# Altium project PAY_IF.PrjPcb (part 2 of 3)

## Sheet SAMA7D65_PIO.SchDoc
size 420 x 297 mm; SheetNumber: 8; SheetTotal: 23
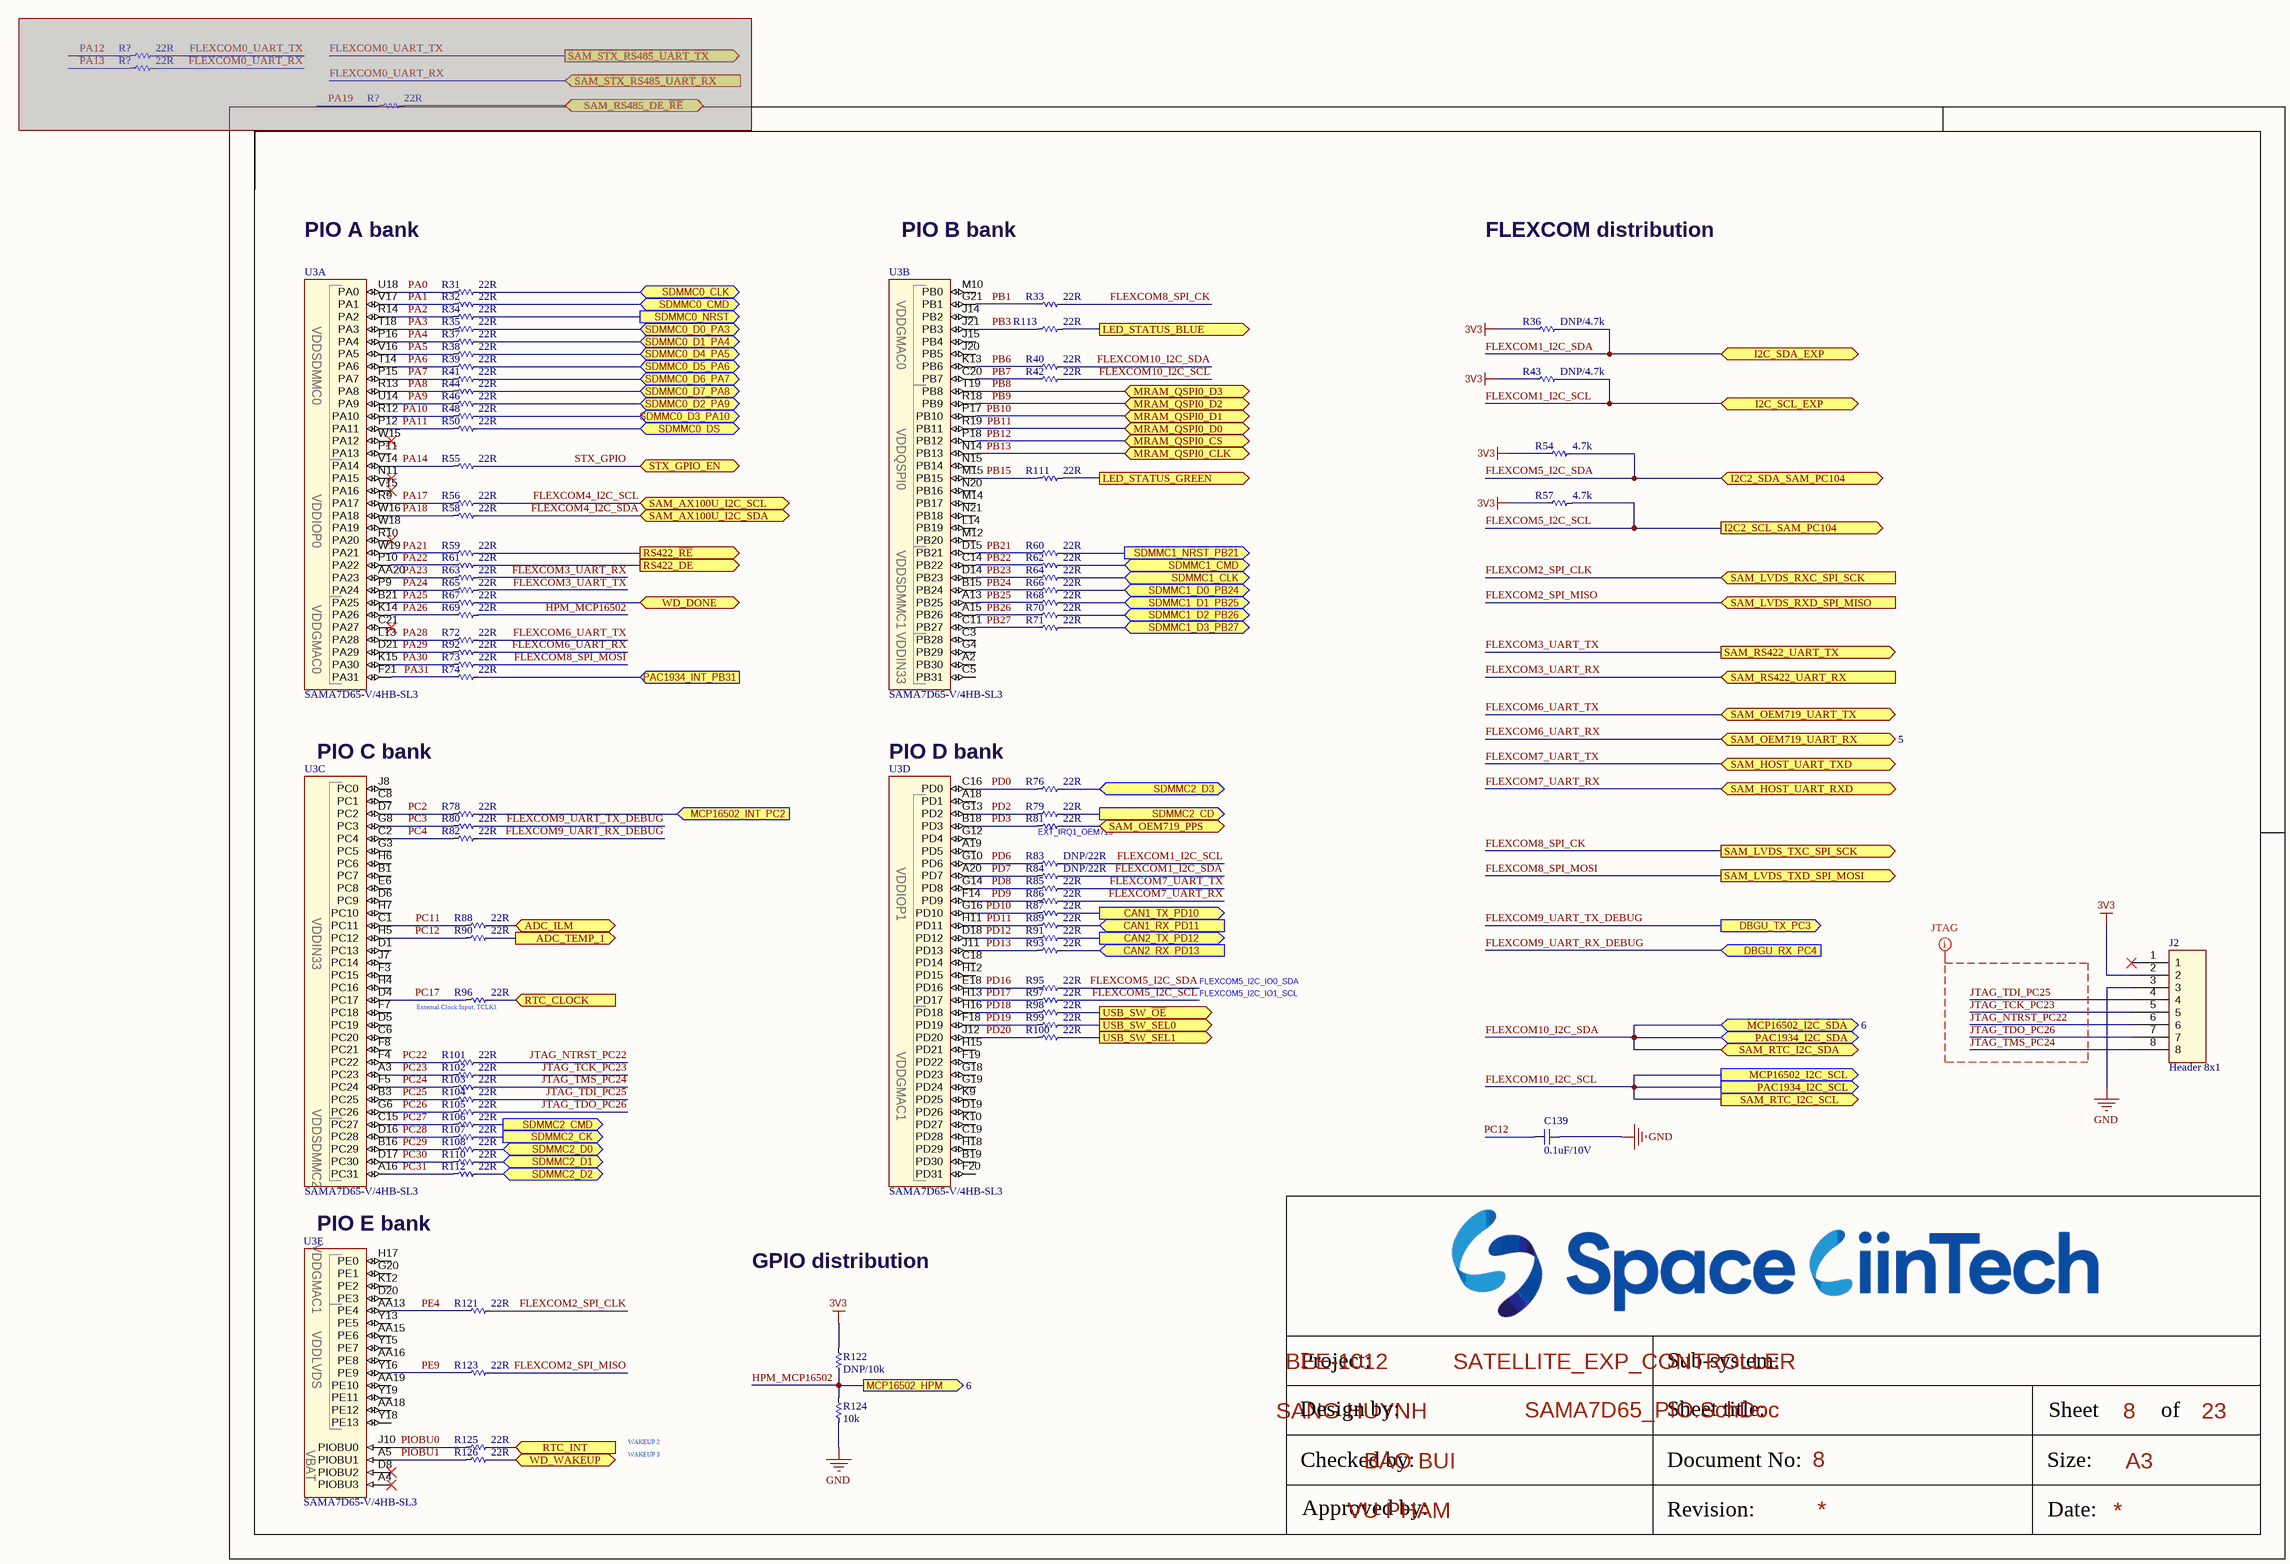
[diagram p8: SAMA7D65_PIO.SchDoc]

### Parts
(Parts that share a designator on the sheet are numbered #1, #2 ... from top to bottom, then left to right.)
C139  0.1uF/10V  [CAP_C_0603x30]
J2  Header 8x1  [Header_254P_8x1]
R31  22R  [RES_C_0603X30]
R32  22R  [RES_C_0603X30]
R33  22R  [RES_C_0603X30]
R34  22R  [RES_C_0603X30]
R35  22R  [RES_C_0603X30]
R36  DNP/4.7k  [RES_C_0603X30]
R37  22R  [RES_C_0603X30]
R38  22R  [RES_C_0603X30]
R39  22R  [RES_C_0603X30]
R40  22R  [RES_C_0603X30]
R41  22R  [RES_C_0603X30]
R42  22R  [RES_C_0603X30]
R43  DNP/4.7k  [RES_C_0603X30]
R44  22R  [RES_C_0603X30]
R46  22R  [RES_C_0603X30]
R48  22R  [RES_C_0603X30]
R50  22R  [RES_C_0603X30]
R54  4.7k  [RES_C_0603X30]
R55  22R  [RES_C_0603X30]
R56  22R  [RES_C_0603X30]
R57  4.7k  [RES_C_0603X30]
R58  22R  [RES_C_0603X30]
R59  22R  [RES_C_0603X30]
R60  22R  [RES_C_0603X30]
R61  22R  [RES_C_0603X30]
R62  22R  [RES_C_0603X30]
R63  22R  [RES_C_0603X30]
R64  22R  [RES_C_0603X30]
R65  22R  [RES_C_0603X30]
R66  22R  [RES_C_0603X30]
R67  22R  [RES_C_0603X30]
R68  22R  [RES_C_0603X30]
R69  22R  [RES_C_0603X30]
R70  22R  [RES_C_0603X30]
R71  22R  [RES_C_0603X30]
R72  22R  [RES_C_0603X30]
R73  22R  [RES_C_0603X30]
R74  22R  [RES_C_0603X30]
R76  22R  [RES_C_0603X30]
R78  22R  [RES_C_0603X30]
R79  22R  [RES_C_0603X30]
R80  22R  [RES_C_0603X30]
R81  22R  [RES_C_0603X30]
R82  22R  [RES_C_0603X30]
R83  DNP/22R  [RES_C_0603X30]
R84  DNP/22R  [RES_C_0603X30]
R85  22R  [RES_C_0603X30]
R86  22R  [RES_C_0603X30]
R87  22R  [RES_C_0603X30]
R88  22R  [RES_C_0603X30]
R89  22R  [RES_C_0603X30]
R90  22R  [RES_C_0603X30]
R91  22R  [RES_C_0603X30]
R92  22R  [RES_C_0603X30]
R93  22R  [RES_C_0603X30]
R95  22R  [RES_C_0603X30]
R96  22R  [RES_C_0603X30]
R97  22R  [RES_C_0603X30]
R98  22R  [RES_C_0603X30]
R99  22R  [RES_C_0603X30]
R100  22R  [RES_C_0603X30]
R101  22R  [RES_C_0603X30]
R102  22R  [RES_C_0603X30]
R103  22R  [RES_C_0603X30]
R104  22R  [RES_C_0603X30]
R105  22R  [RES_C_0603X30]
R106  22R  [RES_C_0603X30]
R107  22R  [RES_C_0603X30]
R108  22R  [RES_C_0603X30]
R110  22R  [RES_C_0603X30]
R111  22R  [RES_C_0603X30]
R112  22R  [RES_C_0603X30]
R113  22R  [RES_C_0603X30]
R121  22R  [RES_C_0603X30]
R122  DNP/10k  [RES_C_1005x30_L]
R123  22R  [RES_C_0603X30]
R124  10k  [RES_C_1005x30_L]
R125  22R  [RES_C_0603X30]
R126  22R  [RES_C_0603X30]
R?#1  22R  [RES_C_0603X30]  (masked out: inside a compile mask, not in the netlist)
R?#2  22R  [RES_C_0603X30]  (masked out: inside a compile mask, not in the netlist)
R?#3  22R  [RES_C_0603X30]  (masked out: inside a compile mask, not in the netlist)
U3#2  value SAMA7D65-V/4HB-SL3  [TFBGA-343_14x14]  (hidden comment: SAMA7D65)  (parts A,B,C,D,E of 8)

### Ports
ADC_ILM (bidir, see 3), ADC_TEMP_1 (out, see 15), CAN1_RX_PD11 (in, see 19), CAN1_TX_PD10 (out, see 19), CAN2_RX_PD13 (in, see 19), CAN2_TX_PD12 (out, see 19), DBGU_RX_PC4 (in, see 14), DBGU_TX_PC3 (out, see 14), I2C2_SCL_SAM_PC104 (out, see 5), I2C2_SDA_SAM_PC104 (bidir, see 5), I2C_SCL_EXP (bidir, see 4, 5), I2C_SDA_EXP (bidir, see 4, 5), LED_STATUS_BLUE (out, see 22), LED_STATUS_GREEN (out, see 22), MCP16502_HPM (out, see 6), MCP16502_I2C_SCL (out, see 6), MCP16502_I2C_SDA (bidir, see 6), MCP16502_INT_PC2 (in, see 6), MRAM_QSPI0_CLK (bidir, see 12), MRAM_QSPI0_CS (bidir, see 12), MRAM_QSPI0_D0 (bidir, see 12), MRAM_QSPI0_D1 (bidir, see 12), MRAM_QSPI0_D2 (bidir, see 12), MRAM_QSPI0_D3 (bidir, see 12), PAC1934_I2C_SCL (out, see 6), PAC1934_I2C_SDA (bidir, see 6), PAC1934_INT_PB31 (in, see 6), RS422_DE (out, see 21), RS422_~{RE} (out, see 21), RTC_CLOCK (in, see 16), RTC_INT (in, see 16), SAM_AX100U_I2C_SCL (bidir, see 5), SAM_AX100U_I2C_SDA (bidir, see 5), SAM_HOST_UART_RXD (bidir, see 5), SAM_HOST_UART_TXD (bidir, see 5), SAM_LVDS_RXC_SPI_SCK (in, see 18), SAM_LVDS_RXD_SPI_MISO (in, see 18), SAM_LVDS_TXC_SPI_SCK (out, see 18), SAM_LVDS_TXD_SPI_MOSI (out, see 18), SAM_OEM719_PPS (bidir, see 5), SAM_OEM719_UART_RX (bidir, see 5), SAM_OEM719_UART_TX (bidir, see 5), SAM_RS422_UART_RX (in, see 21), SAM_RS422_UART_TX (out, see 21), SAM_RS485_DE_~{RE} (bidir), SAM_RTC_I2C_SCL (out, see 16), SAM_RTC_I2C_SDA (bidir, see 16), SAM_STX_RS485_UART_RX (in), SAM_STX_RS485_UART_TX (out), SDMMC0_CLK (bidir, see 11), SDMMC0_CMD (bidir, see 11), SDMMC0_D0_PA3 (bidir, see 11), SDMMC0_D1_PA4 (bidir, see 11), SDMMC0_D2_PA9 (bidir, see 11), SDMMC0_D3_PA10 (bidir, see 11), SDMMC0_D4_PA5 (bidir, see 11), SDMMC0_D5_PA6 (bidir, see 11), SDMMC0_D6_PA7 (bidir, see 11), SDMMC0_D7_PA8 (bidir, see 11), SDMMC0_DS (bidir, see 11), SDMMC0_NRST (out, see 11), SDMMC1_CLK (bidir, see 11), SDMMC1_CMD (bidir, see 11), SDMMC1_D0_PB24 (bidir, see 11), SDMMC1_D1_PB25 (bidir, see 11), SDMMC1_D2_PB26 (bidir, see 11), SDMMC1_D3_PB27 (bidir, see 11), SDMMC1_NRST_PB21 (out, see 11), SDMMC2_CD (out, see 10), SDMMC2_CK (out, see 10), SDMMC2_CMD (out, see 10), SDMMC2_D0 (bidir, see 10), SDMMC2_D1 (bidir, see 10), SDMMC2_D2 (bidir, see 10), SDMMC2_D3 (bidir, see 10), STX_GPIO_EN (bidir, see 5), USB_SW_SEL0 (out, see 13), USB_SW_SEL1 (out, see 13), USB_SW_~{OE} (out, see 13), WD_DONE (bidir, see 17), WD_WAKEUP (bidir, see 17)

### Nets
3V3: J2.2 R36.1 R43.1 R54.1 R57.1 R122.1
GND: C139.1 J2.3 R124.2
ADC_TEMP_1: R90.2 ; port ADC_TEMP_1
FLEXCOM1_I2C_SCL: R43.2 R83.2 ; port I2C_SCL_EXP
FLEXCOM1_I2C_SDA: R36.2 R84.2 ; port I2C_SDA_EXP
FLEXCOM2_SPI_CLK: R121.2 ; port SAM_LVDS_RXC_SPI_SCK
FLEXCOM2_SPI_MISO: R123.2 ; port SAM_LVDS_RXD_SPI_MISO
FLEXCOM3_UART_RX: R63.2 ; port SAM_RS422_UART_RX
FLEXCOM3_UART_TX: R65.2 ; port SAM_RS422_UART_TX
FLEXCOM4_I2C_SCL: R56.2 ; port SAM_AX100U_I2C_SCL
FLEXCOM4_I2C_SDA: R58.2 ; port SAM_AX100U_I2C_SDA
FLEXCOM5_I2C_SCL: R57.2 R97.2 ; port I2C2_SCL_SAM_PC104
FLEXCOM5_I2C_SDA: R54.2 R95.2 ; port I2C2_SDA_SAM_PC104
FLEXCOM6_UART_RX: R92.2 ; port SAM_OEM719_UART_RX
FLEXCOM6_UART_TX: R72.2 ; port SAM_OEM719_UART_TX
FLEXCOM7_UART_RX: R86.2 ; port SAM_HOST_UART_RXD
FLEXCOM7_UART_TX: R85.2 ; port SAM_HOST_UART_TXD
FLEXCOM8_SPI_CK: R33.2 ; port SAM_LVDS_TXC_SPI_SCK
FLEXCOM8_SPI_MOSI: R73.2 ; port SAM_LVDS_TXD_SPI_MOSI
FLEXCOM9_UART_RX_DEBUG: R82.2 ; port DBGU_RX_PC4
FLEXCOM9_UART_TX_DEBUG: R80.2 ; port DBGU_TX_PC3
FLEXCOM10_I2C_SCL: R42.2 ; port MCP16502_I2C_SCL, port PAC1934_I2C_SCL, port SAM_RTC_I2C_SCL
FLEXCOM10_I2C_SDA: R40.2 ; port MCP16502_I2C_SDA, port PAC1934_I2C_SDA, port SAM_RTC_I2C_SDA
HPM_MCP16502: R69.2 R122.2 R124.1 ; port MCP16502_HPM
JTAG_NTRST_PC22: J2.6 R101.2
JTAG_TCK_PC23: J2.5 R102.2
JTAG_TDI_PC25: J2.4 R104.2
JTAG_TDO_PC26: J2.7 R105.2
JTAG_TMS_PC24: J2.8 R103.2
PA0: R31.1 U3#2.U18(PA0)
PA1: R32.1 U3#2.V17(PA1)
PA2: R34.1 U3#2.R14(PA2)
PA3: R35.1 U3#2.T18(PA3)
PA4: R37.1 U3#2.P16(PA4)
PA5: R38.1 U3#2.V16(PA5)
PA6: R39.1 U3#2.T14(PA6)
PA7: R41.1 U3#2.P15(PA7)
PA8: R44.1 U3#2.R13(PA8)
PA9: R46.1 U3#2.U14(PA9)
PA10: R48.1 U3#2.R12(PA10)
PA11: R50.1 U3#2.P12(PA11)
PA14: R55.1 U3#2.V14(PA14)
PA17: R56.1 U3#2.R9(PA17)
PA18: R58.1 U3#2.W16(PA18)
PA21: R59.1 U3#2.W19(PA21)
PA22: R61.1 U3#2.P10(PA22)
PA23: R63.1 U3#2.AA20(PA23)
PA24: R65.1 U3#2.P9(PA24)
PA25: R67.1 U3#2.B21(PA25)
PA26: R69.1 U3#2.K14(PA26)
PA28: R72.1 U3#2.L13(PA28)
PA29: R92.1 U3#2.D21(PA29)
PA30: R73.1 U3#2.K15(PA30)
PA31: R74.1 U3#2.F21(PA31)
PB1: R33.1 U3#2.G21(PB1)
PB3: R113.1 U3#2.J21(PB3)
PB6: R40.1 U3#2.K13(PB6)
PB7: R42.1 U3#2.C20(PB7)
PB8: U3#2.T19(PB8) ; port MRAM_QSPI0_D3  [project net MRAM_QSPI_D3]
PB9: U3#2.R18(PB9) ; port MRAM_QSPI0_D2  [project net MRAM_QSPI_D2]
PB10: U3#2.P17(PB10) ; port MRAM_QSPI0_D1  [project net MRAM_QSPI_D1]
PB11: U3#2.R19(PB11) ; port MRAM_QSPI0_D0  [project net MRAM_QSPI_D0]
PB12: U3#2.P18(PB12) ; port MRAM_QSPI0_CS  [project net MRAM_QSPI_CS]
PB13: U3#2.N14(PB13) ; port MRAM_QSPI0_CLK  [project net MRAM_QSPI_CLK]
PB15: R111.1 U3#2.M15(PB15)
PB21: R60.1 U3#2.D15(PB21)
PB22: R62.1 U3#2.C14(PB22)
PB23: R64.1 U3#2.D14(PB23)
PB24: R66.1 U3#2.B15(PB24)
PB25: R68.1 U3#2.A13(PB25)
PB26: R70.1 U3#2.A15(PB26)
PB27: R71.1 U3#2.C11(PB27)
PC2: R78.1 U3#2.D7(PC2)
PC3: R80.1 U3#2.G8(PC3)
PC4: R82.1 U3#2.C2(PC4)
PC11: R88.1 U3#2.C1(PC11)
PC12: C139.2 R90.1 U3#2.H5(PC12)
PC17: R96.1 U3#2.D4(PC17)
PC22: R101.1 U3#2.F4(PC22)
PC23: R102.1 U3#2.A3(PC23)
PC24: R103.1 U3#2.F5(PC24)
PC25: R104.1 U3#2.B3(PC25)
PC26: R105.1 U3#2.G6(PC26)
PC27: R106.1 U3#2.C15(PC27)
PC28: R107.1 U3#2.D16(PC28)
PC29: R108.1 U3#2.B16(PC29)
PC30: R110.1 U3#2.D17(PC30)
PC31: R112.1 U3#2.A16(PC31)
PD0: R76.1 U3#2.C16(PD0)
PD2: R79.1 U3#2.G13(PD2)
PD3: R81.1 U3#2.B18(PD3)
PD6: R83.1 U3#2.G10(PD6)
PD7: R84.1 U3#2.A20(PD7)
PD8: R85.1 U3#2.G14(PD8)
PD9: R86.1 U3#2.F14(PD9)
PD10: R87.1 U3#2.G16(PD10)
PD11: R89.1 U3#2.H11(PD11)
PD12: R91.1 U3#2.D18(PD12)
PD13: R93.1 U3#2.J11(PD13)
PD16: R95.1 U3#2.E18(PD16)
PD17: R97.1 U3#2.H13(PD17)
PD18: R98.1 U3#2.H16(PD18)
PD19: R99.1 U3#2.F18(PD19)
PD20: R100.1 U3#2.J12(PD20)
PE4: R121.1 U3#2.AA13(PE4)
PE9: R123.1 U3#2.Y16(PE9)
PIOBU0: R125.1 U3#2.J10(PIOBU0)
PIOBU1: R126.1 U3#2.A5(PIOBU1)
RS422_DE: R61.2 ; port RS422_DE
RS422_~{RE}: R59.2 ; port RS422_~{RE}
SDMMC0_CLK: R31.2 ; port SDMMC0_CLK
SDMMC0_CMD: R32.2 ; port SDMMC0_CMD
SDMMC0_D0: R35.2 ; port SDMMC0_D0_PA3
SDMMC0_D1: R37.2 ; port SDMMC0_D1_PA4
SDMMC0_D2: R46.2 ; port SDMMC0_D2_PA9
SDMMC0_D3: R48.2 ; port SDMMC0_D3_PA10
SDMMC0_D4: R38.2 ; port SDMMC0_D4_PA5
SDMMC0_D5: R39.2 ; port SDMMC0_D5_PA6
SDMMC0_D6: R41.2 ; port SDMMC0_D6_PA7
SDMMC0_D7: R44.2 ; port SDMMC0_D7_PA8
SDMMC0_DS: R50.2 ; port SDMMC0_DS
SDMMC0_NRST: R34.2 ; port SDMMC0_NRST
SDMMC1_CLK: R64.2 ; port SDMMC1_CLK
SDMMC1_CMD: R62.2 ; port SDMMC1_CMD
SDMMC1_D0: R66.2 ; port SDMMC1_D0_PB24
SDMMC1_D1: R68.2 ; port SDMMC1_D1_PB25
SDMMC1_D2: R70.2 ; port SDMMC1_D2_PB26
SDMMC1_D3: R71.2 ; port SDMMC1_D3_PB27
SDMMC1_NRST: R60.2 ; port SDMMC1_NRST_PB21
SDMMC2_CD: R79.2 ; port SDMMC2_CD
SDMMC2_CK: R107.2 ; port SDMMC2_CK
SDMMC2_CMD: R106.2 ; port SDMMC2_CMD
SDMMC2_D0: R108.2 ; port SDMMC2_D0
SDMMC2_D1: R110.2 ; port SDMMC2_D1
SDMMC2_D2: R112.2 ; port SDMMC2_D2
SDMMC2_D3: R76.2 ; port SDMMC2_D3
STX_GPIO: R55.2 ; port STX_GPIO_EN
NetD2_2: R113.2 ; port LED_STATUS_BLUE
NetD3_2: R111.2 ; port LED_STATUS_GREEN
NetJ14#1_19: R81.2 ; port SAM_OEM719_PPS
NetR8_1: R78.2 ; port MCP16502_INT_PC2
NetR10_1: R74.2 ; port PAC1934_INT_PB31
NetR67_2: R67.2 ; port WD_DONE
NetR87_2: R87.2 ; port CAN1_TX_PD10
NetR88_2: R88.2 ; port ADC_ILM
NetR89_2: R89.2 ; port CAN1_RX_PD11
NetR91_2: R91.2 ; port CAN2_TX_PD12
NetR93_2: R93.2 ; port CAN2_RX_PD13
NetR96_2: R96.2 ; port RTC_CLOCK
NetR98_2: R98.2 ; port USB_SW_~{OE}
NetR99_2: R99.2 ; port USB_SW_SEL0
NetR100_2: R100.2 ; port USB_SW_SEL1
NetR125_2: R125.2 ; port RTC_INT
NetR126_2: R126.2 ; port WD_WAKEUP

Not connected (* = marked no-connect by the designer): J2 1*; U3#2 A2(PB30) A4(PIOBU3)* A18(PD1) A19(PD5) AA15(PE6) AA16(PE8) AA18(PE12) AA19(PE10) B1(PC7) B19(PD30) C3(PB28) C5(PB31) C6(PC20) C8(PC1) C18(PD14) C19(PD28) C21(PA27)* D1(PC13) D5(PC19) D6(PC9) D8(PIOBU2)* D19(PD26) D20(PE3) E6(PC8) F3(PC15) F7(PC18) F8(PC21) F19(PD22) F20(PD31) G3(PC5) G4(PB29) G12(PD4) G18(PD23) G19(PD24) G20(PE1) H4(PC16) H6(PC6) H7(PC10) H12(PD15) H15(PD21) H17(PE0) H18(PD29) J7(PC14) J8(PC0) J14(PB2) J15(PB4) J20(PB5) K9(PD25) K10(PD27) K12(PE2) L14(PB19) M10(PB0) M12(PB20) M14(PB17) N11(PA15)* N15(PB14) N20(PB16) N21(PB18) P11(PA13) R10(PA20)* V15(PA16)* W15(PA12)* W18(PA19) Y13(PE5) Y15(PE7) Y18(PE13) Y19(PE11)

### Layout directives
net class JTAG; rule Matched Net Lengths [Tolerance = 2mm]: JTAG_NTRST_PC22, JTAG_TCK_PC23, JTAG_TDI_PC25, JTAG_TDO_PC26, JTAG_TMS_PC24

### Notes on the sheet
- PIO A bank
- PIO B bank
- FLEXCOM distribution
- (near U3#2) PIO C bank
- (near U3#2) PIO D bank
- (near R81) EXT_IRQ1_OEM719
- (near R96) External Clock Input, TCLK1
- FLEXCOM5_I2C_IO0_SDA
- FLEXCOM5_I2C_IO1_SCL
- (near U3#2) PIO E bank
- GPIO distribution
- WAKEUP 2
- WAKEUP 3
- Project:
- BEE-1012
- Sub-system:
- SATELLITE_EXP_CONTROLLER
- Design by:
- SANG HUYNH
- BAO BUI
- Sheet title:
- Sheet
- A3
- of
- Checked by:
- Approved by:
- VU PHAM
- Revision:
- Document No:
- Size:
- Date:

### Library data of the parts
C139 = _CAP_C_2: CAP CHIP
R31-R44 R46 R48 R50 R54-R74 R76 R78-R93 R95-R108 R110-R113 R121-R126 R?#1-R?#3 = _RES_B_2: RES
U3#2 = SAMA7D65: as U3#2 on sheet SAMA7D65_MPU; Manufacturer Part Number 1: SAMA7D65-V/4HB-SL3; Type: 32-Bit MPU; Status: MCL Design; Revision: 1; Category: MCHP-Microcontroller; ComponentLink1URL: https://www.microchip.com/sitesearch/search/Product%20and%20Development%20Tools/SAMA7D65-V/4HB-SL3; ComponentLink1Description: SVN Datasheet; ComponentLink2Description: Local Datasheet; ComponentLink3URL: C:\ALTIUM_WORK\00001_MCHP-CDB\Library\LibraryRefs\SAMA7D65-TFBGA-343.SchLib; ComponentLink3Description: Open Symbol; ComponentLink4URL: C:\ALTIUM_WORK\00001_MCHP-CDB\Library\Footprints\TFBGA-343_14x14.PcbLib; ComponentLink4Description: Open Footprint; ComponentLink5Description: Open Footprint 2; ComponentLink6Description: Open Footprint 3; ComponentLink7Description: Open Footprint 4; Supplier 1: Microchip Technology; Supplier Part Number 1: SAMA7D65-V/4HB-SL3; Operating Temperature: -40C to +105C; Quantity Override: 1

## Sheet SAMA7D65_DDR3L.SchDoc
size 420 x 297 mm; SheetNumber: 9; SheetTotal: 23
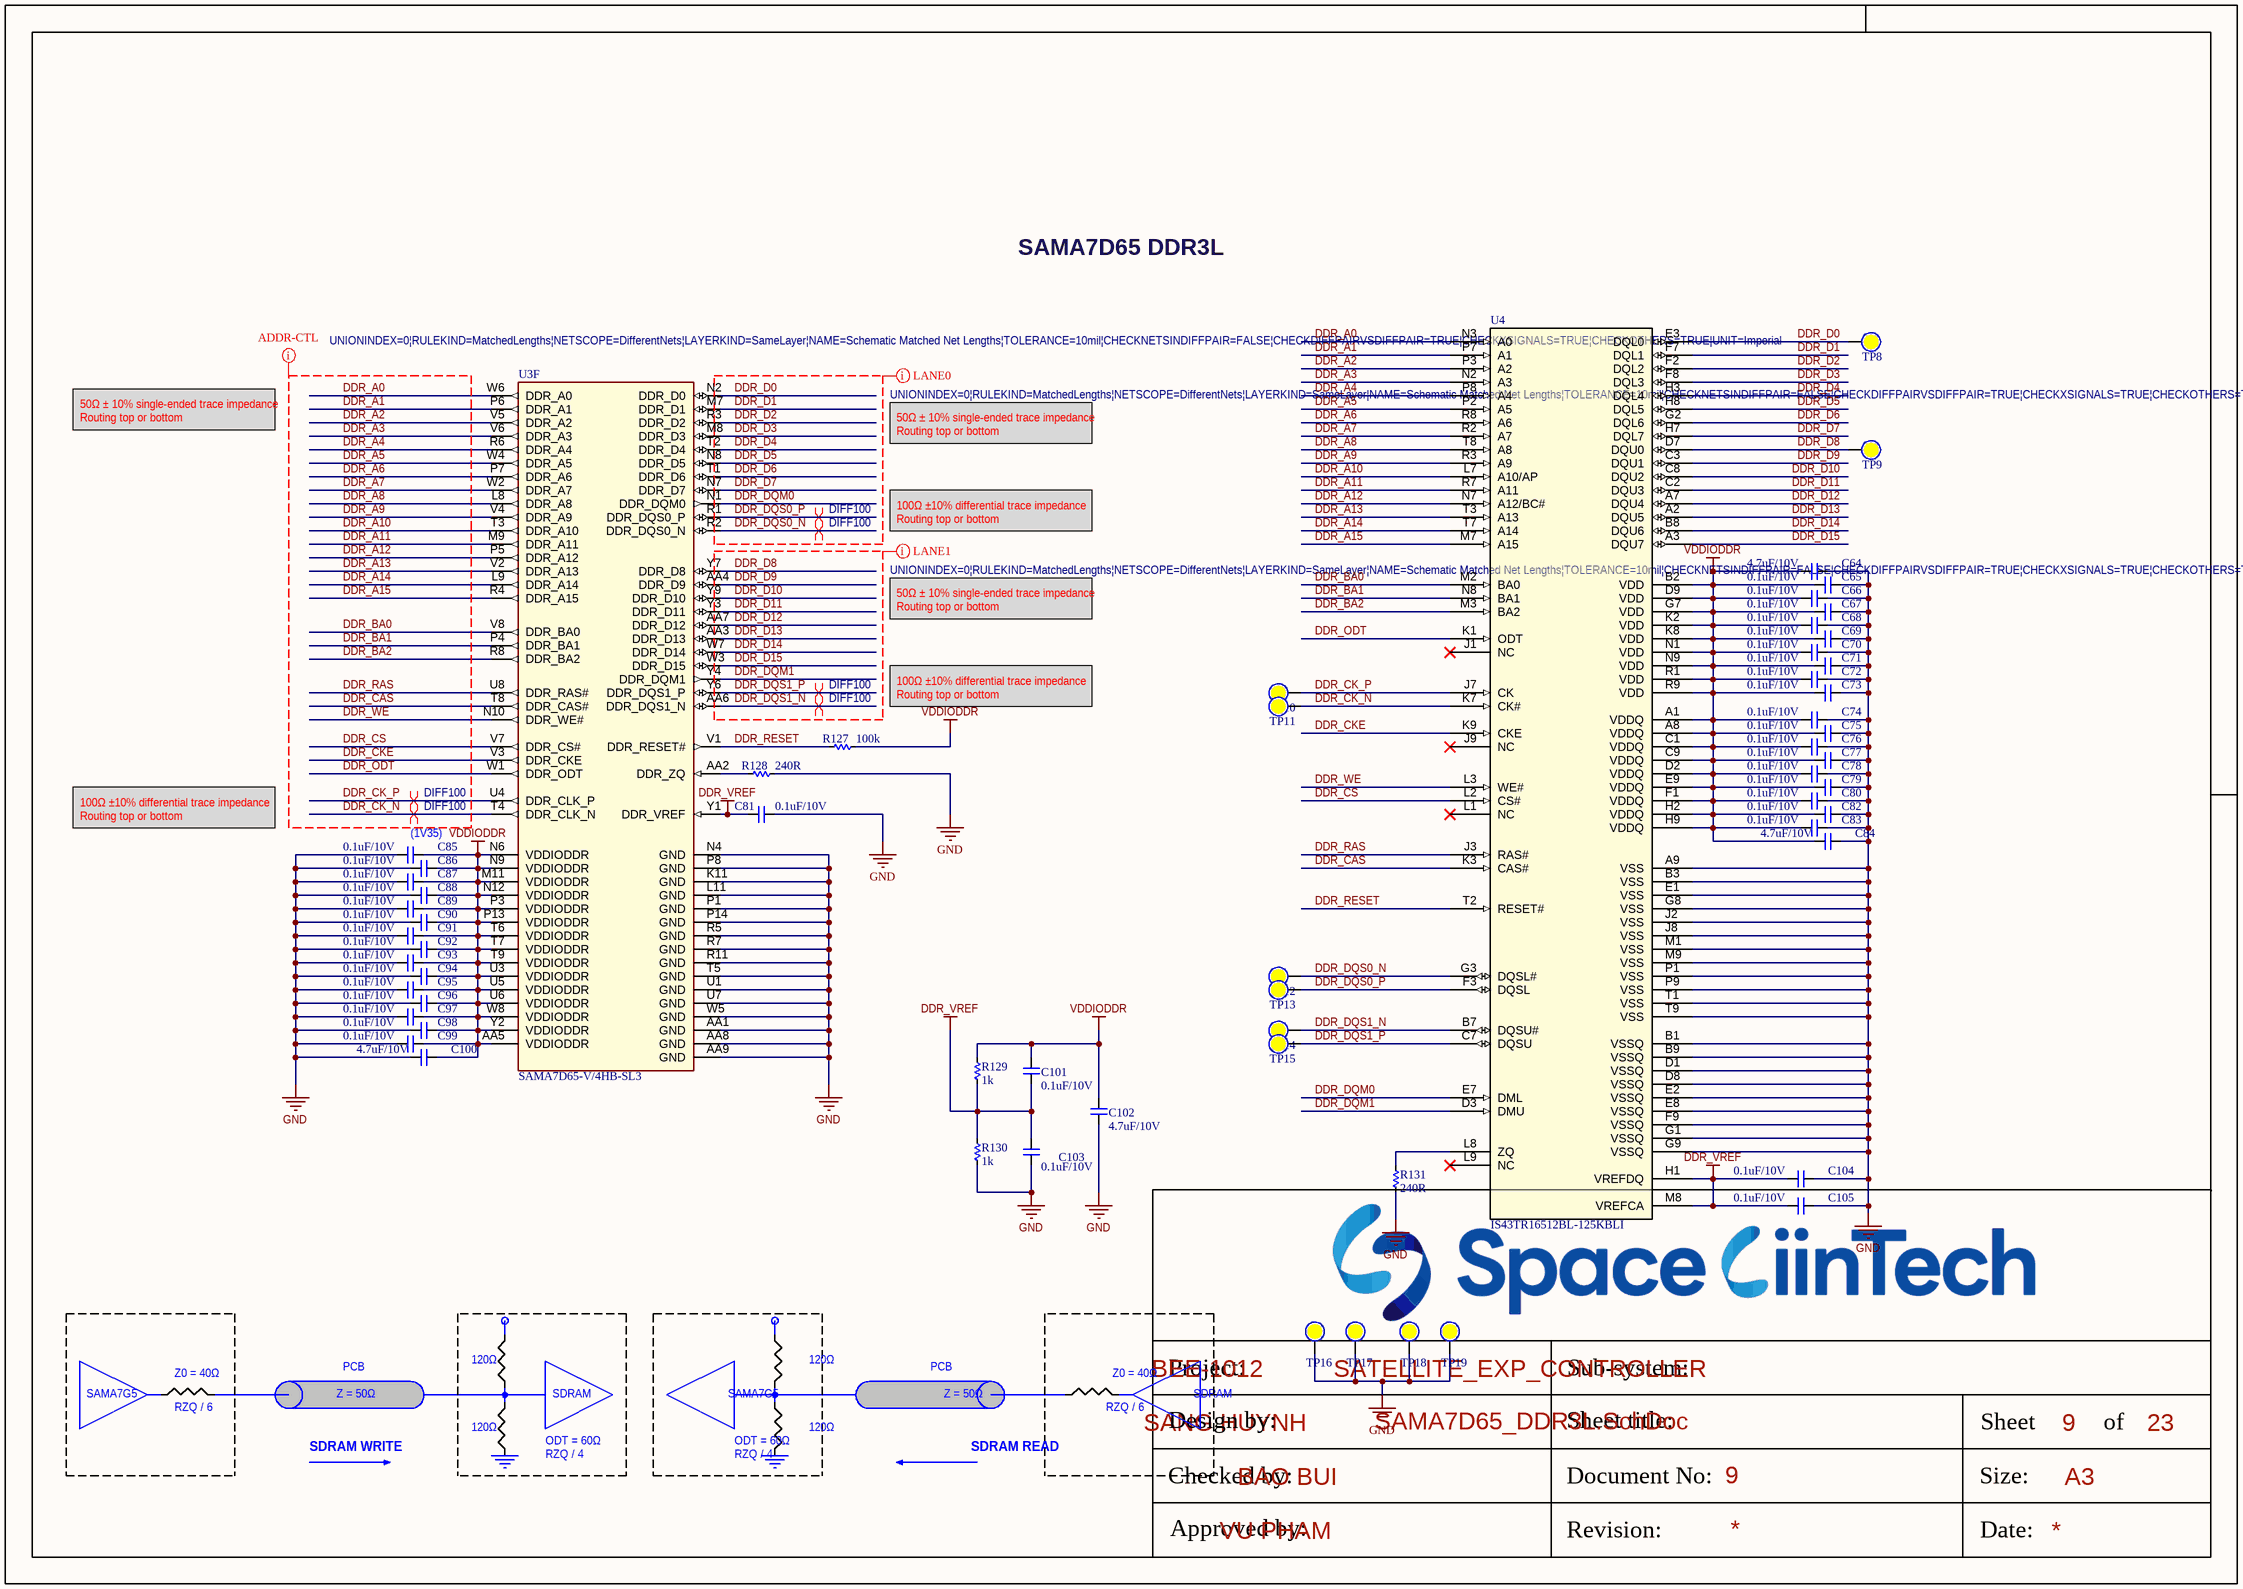
[diagram p9: SAMA7D65_DDR3L.SchDoc]

### Parts
(Parts that share a designator on the sheet are numbered #1, #2 ... from top to bottom, then left to right.)
C64  4.7uF/10V  [CAP_C_1005X50_L]
C65  0.1uF/10V  [CAP_C_0603x30]
C66  0.1uF/10V  [CAP_C_0603x30]
C67  0.1uF/10V  [CAP_C_0603x30]
C68  0.1uF/10V  [CAP_C_0603x30]
C69  0.1uF/10V  [CAP_C_0603x30]
C70  0.1uF/10V  [CAP_C_0603x30]
C71  0.1uF/10V  [CAP_C_0603x30]
C72  0.1uF/10V  [CAP_C_0603x30]
C73  0.1uF/10V  [CAP_C_0603x30]
C74  0.1uF/10V  [CAP_C_0603x30]
C75  0.1uF/10V  [CAP_C_0603x30]
C76  0.1uF/10V  [CAP_C_0603x30]
C77  0.1uF/10V  [CAP_C_0603x30]
C78  0.1uF/10V  [CAP_C_0603x30]
C79  0.1uF/10V  [CAP_C_0603x30]
C80  0.1uF/10V  [CAP_C_0603x30]
C81  0.1uF/10V  [CAP_C_0603x30]
C82  0.1uF/10V  [CAP_C_0603x30]
C83  0.1uF/10V  [CAP_C_0603x30]
C84  4.7uF/10V  [CAP_C_1005X50_L]
C85  0.1uF/10V  [CAP_C_0603x30]
C86  0.1uF/10V  [CAP_C_0603x30]
C87  0.1uF/10V  [CAP_C_0603x30]
C88  0.1uF/10V  [CAP_C_0603x30]
C89  0.1uF/10V  [CAP_C_0603x30]
C90  0.1uF/10V  [CAP_C_0603x30]
C91  0.1uF/10V  [CAP_C_0603x30]
C92  0.1uF/10V  [CAP_C_0603x30]
C93  0.1uF/10V  [CAP_C_0603x30]
C94  0.1uF/10V  [CAP_C_0603x30]
C95  0.1uF/10V  [CAP_C_0603x30]
C96  0.1uF/10V  [CAP_C_0603x30]
C97  0.1uF/10V  [CAP_C_0603x30]
C98  0.1uF/10V  [CAP_C_0603x30]
C99  0.1uF/10V  [CAP_C_0603x30]
C100  4.7uF/10V  [CAP_C_1005X50_L]
C101  0.1uF/10V  [CAP_C_0603x30]
C102  4.7uF/10V  [CAP_C_1005X50_L]
C103  0.1uF/10V  [CAP_C_0603x30]
C104  0.1uF/10V  [CAP_C_0603x30]
C105  0.1uF/10V  [CAP_C_0603x30]
R127  100k  [RES_C_0603X30]
R128  240R  [RES_C_0603X30]
R129  1k  [RES_C_0603X30]
R130  1k  [RES_C_0603X30]
R131  240R  [RES_C_0603X30]
TP8  (no value)  [Test point]  (no BOM)
TP9  (no value)  [Test point]  (no BOM)
TP10  (no value)  [Test point]  (no BOM)
TP11  (no value)  [Test point]  (no BOM)
TP12  (no value)  [Test point]  (no BOM)
TP13  (no value)  [Test point]  (no BOM)
TP14  (no value)  [Test point]  (no BOM)
TP15  (no value)  [Test point]  (no BOM)
TP16  (no value)  [Test point]  (no BOM)
TP17  (no value)  [Test point]  (no BOM)
TP18  (no value)  [Test point]  (no BOM)
TP19  (no value)  [Test point]  (no BOM)
U3#2  value SAMA7D65-V/4HB-SL3  [TFBGA-343_14x14]  (hidden comment: SAMA7D65)  (part F of 8)
U4  IS43TR16512BL-125KBLI  [TWBGA96_ISI]

### Nets
DDR_VREF: C81.1 C101.1 C103.2 C104.1 C105.1 R129.1 R130.2 U3#2.Y1(DDR_VREF) U4.H1(VREFDQ) U4.M8(VREFCA)
GND: C64.2 C65.2 C66.2 C67.2 C68.2 C69.2 C70.2 C71.2 C72.2 C73.2 C74.2 C75.2 C76.2 C77.2 C78.2 C79.2 C80.2 C81.2 C82.2 C83.2 C84.2 C85.1 C86.1 C87.1 C88.1 C89.1 C90.1 C91.1 C92.1 C93.1 C94.1 C95.1 C96.1 C97.1 C98.1 C99.1 C100.1 C102.1 C103.1 C104.2 C105.2 R128.2 R130.1 R131.1 TP16.0 TP17.0 TP18.0 TP19.0 U3#2.AA1(GND) U3#2.AA8(GND) U3#2.AA9(GND) U3#2.K11(GND) U3#2.L11(GND) U3#2.N4(GND) U3#2.P1(GND) U3#2.P8(GND) U3#2.P14(GND) U3#2.R5(GND) U3#2.R7(GND) U3#2.R11(GND) U3#2.T5(GND) U3#2.U1(GND) U3#2.U7(GND) U3#2.W5(GND) U4.A9(VSS) U4.B1(VSSQ) U4.B3(VSS) U4.B9(VSSQ) U4.D1(VSSQ) U4.D8(VSSQ) U4.E1(VSS) U4.E2(VSSQ) U4.E8(VSSQ) U4.F9(VSSQ) U4.G1(VSSQ) U4.G8(VSS) U4.G9(VSSQ) U4.J2(VSS) U4.J8(VSS) U4.M1(VSS) U4.M9(VSS) U4.P1(VSS) U4.P9(VSS) U4.T1(VSS) U4.T9(VSS)
VDDIODDR: C64.1 C65.1 C66.1 C67.1 C68.1 C69.1 C70.1 C71.1 C72.1 C73.1 C74.1 C75.1 C76.1 C77.1 C78.1 C79.1 C80.1 C82.1 C83.1 C84.1 C85.2 C86.2 C87.2 C88.2 C89.2 C90.2 C91.2 C92.2 C93.2 C94.2 C95.2 C96.2 C97.2 C98.2 C99.2 C100.2 C101.2 C102.2 R127.2 R129.2 U3#2.AA5(VDDIODDR) U3#2.M11(VDDIODDR) U3#2.N6(VDDIODDR) U3#2.N9(VDDIODDR) U3#2.N12(VDDIODDR) U3#2.P3(VDDIODDR) U3#2.P13(VDDIODDR) U3#2.T6(VDDIODDR) U3#2.T7(VDDIODDR) U3#2.T9(VDDIODDR) U3#2.U3(VDDIODDR) U3#2.U5(VDDIODDR) U3#2.U6(VDDIODDR) U3#2.W8(VDDIODDR) U3#2.Y2(VDDIODDR) U4.A1(VDDQ) U4.A8(VDDQ) U4.B2(VDD) U4.C1(VDDQ) U4.C9(VDDQ) U4.D2(VDDQ) U4.D9(VDD) U4.E9(VDDQ) U4.F1(VDDQ) U4.G7(VDD) U4.H2(VDDQ) U4.H9(VDDQ) U4.K2(VDD) U4.K8(VDD) U4.N1(VDD) U4.N9(VDD) U4.R1(VDD) U4.R9(VDD)
DDR_A0: U3#2.W6(DDR_A0) U4.N3(A0)
DDR_A1: U3#2.P6(DDR_A1) U4.P7(A1)
DDR_A2: U3#2.V5(DDR_A2) U4.P3(A2)
DDR_A3: U3#2.V6(DDR_A3) U4.N2(A3)
DDR_A4: U3#2.R6(DDR_A4) U4.P8(A4)
DDR_A5: U3#2.W4(DDR_A5) U4.P2(A5)
DDR_A6: U3#2.P7(DDR_A6) U4.R8(A6)
DDR_A7: U3#2.W2(DDR_A7) U4.R2(A7)
DDR_A8: U3#2.L8(DDR_A8) U4.T8(A8)
DDR_A9: U3#2.V4(DDR_A9) U4.R3(A9)
DDR_A10: U3#2.T3(DDR_A10) U4.L7(A10/AP)
DDR_A11: U3#2.M9(DDR_A11) U4.R7(A11)
DDR_A12: U3#2.P5(DDR_A12) U4.N7(A12/BC#)
DDR_A13: U3#2.V2(DDR_A13) U4.T3(A13)
DDR_A14: U3#2.L9(DDR_A14) U4.T7(A14)
DDR_A15: U3#2.R4(DDR_A15) U4.M7(A15)
DDR_BA0: U3#2.V8(DDR_BA0) U4.M2(BA0)
DDR_BA1: U3#2.P4(DDR_BA1) U4.N8(BA1)
DDR_BA2: U3#2.R8(DDR_BA2) U4.M3(BA2)
DDR_CAS: U3#2.T8(DDR_CAS#) U4.K3(CAS#)
DDR_CK_N: TP11.0 U3#2.T4(DDR_CLK_N) U4.K7(CK#)
DDR_CK_P: TP10.0 U3#2.U4(DDR_CLK_P) U4.J7(CK)
DDR_CKE: U3#2.V3(DDR_CKE) U4.K9(CKE)
DDR_CS: U3#2.V7(DDR_CS#) U4.L2(CS#)
DDR_D0: TP8.0 U3#2.N2(DDR_D0) U4.E3(DQL0)
DDR_D1: U3#2.M7(DDR_D1) U4.F7(DQL1)
DDR_D2: U3#2.R3(DDR_D2) U4.F2(DQL2)
DDR_D3: U3#2.M8(DDR_D3) U4.F8(DQL3)
DDR_D4: U3#2.T2(DDR_D4) U4.H3(DQL4)
DDR_D5: U3#2.N8(DDR_D5) U4.H8(DQL5)
DDR_D6: U3#2.T1(DDR_D6) U4.G2(DQL6)
DDR_D7: U3#2.N7(DDR_D7) U4.H7(DQL7)
DDR_D8: TP9.0 U3#2.Y7(DDR_D8) U4.D7(DQU0)
DDR_D9: U3#2.AA4(DDR_D9) U4.C3(DQU1)
DDR_D10: U3#2.Y9(DDR_D10) U4.C8(DQU2)
DDR_D11: U3#2.Y3(DDR_D11) U4.C2(DQU3)
DDR_D12: U3#2.AA7(DDR_D12) U4.A7(DQU4)
DDR_D13: U3#2.AA3(DDR_D13) U4.A2(DQU5)
DDR_D14: U3#2.W7(DDR_D14) U4.B8(DQU6)
DDR_D15: U3#2.W3(DDR_D15) U4.A3(DQU7)
DDR_DQM0: U3#2.N1(DDR_DQM0) U4.E7(DML)
DDR_DQM1: U3#2.Y4(DDR_DQM1) U4.D3(DMU)
DDR_DQS0_N: TP12.0 U3#2.R2(DDR_DQS0_N) U4.G3(DQSL#)
DDR_DQS0_P: TP13.0 U3#2.R1(DDR_DQS0_P) U4.F3(DQSL)
DDR_DQS1_N: TP14.0 U3#2.AA6(DDR_DQS1_N) U4.B7(DQSU#)
DDR_DQS1_P: TP15.0 U3#2.Y6(DDR_DQS1_P) U4.C7(DQSU)
DDR_ODT: U3#2.W1(DDR_ODT) U4.K1(ODT)
DDR_RAS: U3#2.U8(DDR_RAS#) U4.J3(RAS#)
DDR_RESET: R127.1 U3#2.V1(DDR_RESET#) U4.T2(RESET#)
DDR_WE: U3#2.N10(DDR_WE#) U4.L3(WE#)
NetR128_1: R128.1 U3#2.AA2(DDR_ZQ)
NetR131_2: R131.2 U4.L8(ZQ)

Not connected (* = marked no-connect by the designer): U4 J1(NC)* J9(NC)* L1(NC)* L9(NC)*

### Layout directives
net class DDR-ADDR-CTL; rule Matched Net Lengths [Tolerance = 10mil]: DDR_A0, DDR_A1, DDR_A2, DDR_A3, DDR_A4, DDR_A5, DDR_A6, DDR_A7, DDR_A8, DDR_A9, DDR_A10, DDR_A11, DDR_A12, DDR_A13, DDR_A14, DDR_A15, DDR_BA0, DDR_BA1, DDR_BA2, DDR_CAS, DDR_CK_N, DDR_CK_P, DDR_CKE, DDR_CS, DDR_ODT, DDR_RAS, DDR_WE
differential pair; differential pair class DIFF100; net class DIFF100; rule Matched Net Lengths [Tolerance = 4mil]: DDR_CK_N, DDR_CK_P, DDR_DQS0_N, DDR_DQS0_P, DDR_DQS1_N, DDR_DQS1_P
net class DDR-LANE0; rule Matched Net Lengths [Tolerance = 10mil]: DDR_D0, DDR_D1, DDR_D2, DDR_D3, DDR_D4, DDR_D5, DDR_D6, DDR_D7, DDR_DQM0, DDR_DQS0_N, DDR_DQS0_P
net class DDR-LANE1; rule Matched Net Lengths [Tolerance = 10mil]: DDR_D8, DDR_D9, DDR_D10, DDR_D11, DDR_D12, DDR_D13, DDR_D14, DDR_D15, DDR_DQM1, DDR_DQS1_N, DDR_DQS1_P

### Notes on the sheet
- SAMA7D65 DDR3L
- 50Ω ± 10% single-ended trace impedance
  Routing top or bottom
- 100Ω ±10% differential trace impedance
  Routing top or bottom
- (near C85) (1V35)
- SAMA7G5
- Z0 = 40Ω
- Z = 50Ω
- PCB
- 120Ω
- SDRAM
- RZQ / 6
- SDRAM WRITE
- ODT = 60Ω
- RZQ / 4
- SDRAM READ
- Project:
- BEE-1012
- Sub-system:
- SATELLITE_EXP_CONTROLLER
- Design by:
- SANG HUYNH
- BAO BUI
- Sheet title:
- Sheet
- A3
- of
- Checked by:
- Approved by:
- VU PHAM
- Revision:
- Document No:
- Size:
- Date:

### Library data of the parts
C64-C105 = _CAP_C_2: CAP CHIP
R127-R131 = _RES_B_2: RES
TP8-TP19 = Test Point: Solder: NF
U3#2 = SAMA7D65: SAMA7D65 MPU 1000MHz Cortex-A7 TFBGA-343; Manufacturer 1: Microchip Technology; Description_: MCHP MPU 32-BIT Cortex-A7 1000MHz 128kB SAMA7D65-V/4HB-SL3 TFBGA-343; Populated: YES; MCHP-ID: IC2674; Symbol: SAMA7D65-TFBGA-343; Dev Tools Status: Design; Owner: Ciprian Abramov; Restricted Sourcing: No; Manufacturer Part Number 1: SAMA7D65-V/4HB-SL3; Type: 32-Bit MPU; Status: MCL Design; Revision: 1; Category: MCHP-Microcontroller; ComponentLink1URL: https://www.microchip.com/sitesearch/search/Product%20and%20Development%20Tools/SAMA7D65-V/4HB-SL3; ComponentLink1Description: SVN Datasheet; ComponentLink2Description: Local Datasheet; ComponentLink3URL: C:\ALTIUM_WORK\00001_MCHP-CDB\Library\LibraryRefs\SAMA7D65-TFBGA-343.SchLib; ComponentLink3Description: Open Symbol; ComponentLink4URL: C:\ALTIUM_WORK\00001_MCHP-CDB\Library\Footprints\TFBGA-343_14x14.PcbLib; ComponentLink4Description: Open Footprint; ComponentLink5Description: Open Footprint 2; ComponentLink6Description: Open Footprint 3; ComponentLink7Description: Open Footprint 4; Supplier 1: Microchip Technology; Supplier Part Number 1: SAMA7D65-V/4HB-SL3; Operating Temperature: -40C to +105C; Quantity Override: 1
U4 = IC_RAM_IS43TR16512BL-125KBLI: DDR3L; Manufacturer_Name: ISSI; Copyright: Copyright (C) 2025 Ultra Librarian. All rights reserved.; Manufacturer_Part_Number: IS43TR16512BL-125KBLI; RefDes: RefDes; Type: Type

## Sheet SDCARD.SchDoc
size 420 x 297 mm; SheetNumber: 10; SheetTotal: 23
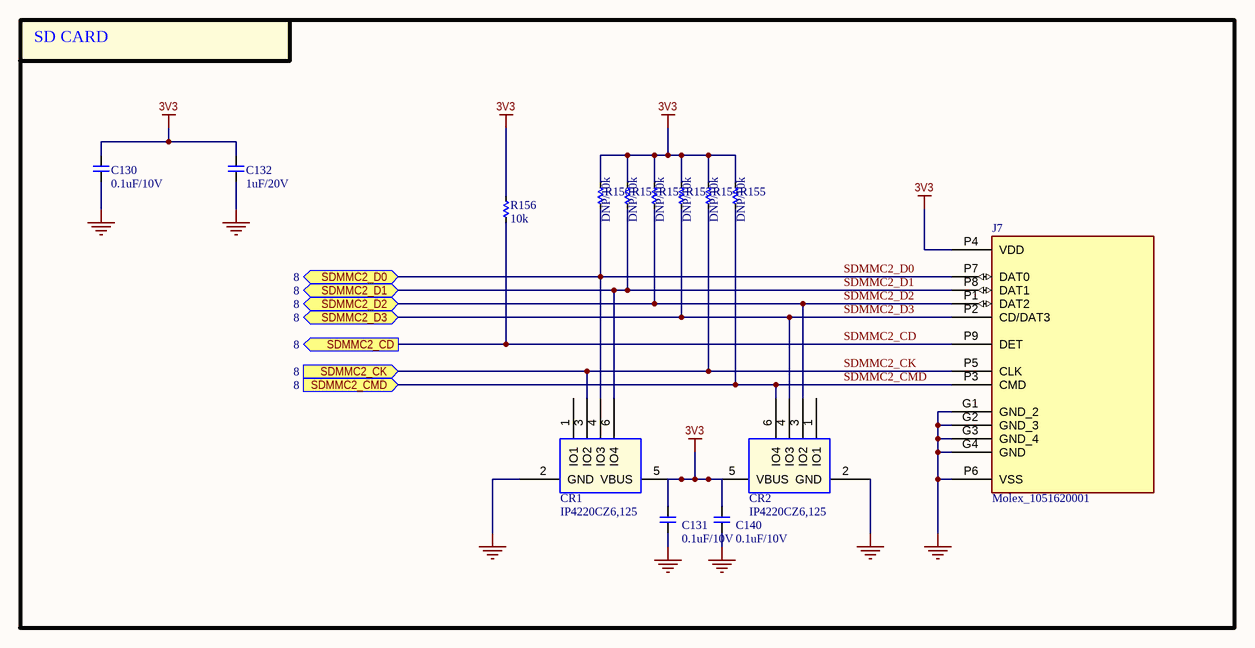
[diagram p10: SDCARD.SchDoc]

### Parts
C130  0.1uF/10V  [CAP_C_1005X50_L]
C131  0.1uF/10V  [CAP_C_1005X50_L]
C132  1uF/20V  [CAP_C_1005X50_L]
C140  0.1uF/10V  [CAP_C_1005X50_L]
CR1  IP4220CZ6,125  [DIODE_SOT457_1P7X3P1_NEX]
CR2  IP4220CZ6,125  [DIODE_SOT457_1P7X3P1_NEX]
J7  Molex_1051620001  [MOLEX_1051620001]
R150  DNP/10k  [RES_C_1005x30_L]
R151  DNP/10k  [RES_C_1005x30_L]
R152  DNP/10k  [RES_C_1005x30_L]
R153  DNP/10k  [RES_C_1005x30_L]
R154  DNP/10k  [RES_C_1005x30_L]
R155  DNP/10k  [RES_C_1005x30_L]
R156  10k  [RES_C_1005x30_L]

### Blocks framed on the sheet
SD CARD: C130-C132 C140 CR1 CR2 J7 R150-R156

### Ports
SDMMC2_CD (out, see 8), SDMMC2_CK (in, see 8), SDMMC2_CMD (in, see 8), SDMMC2_D0 (bidir, see 8), SDMMC2_D1 (bidir, see 8), SDMMC2_D2 (bidir, see 8), SDMMC2_D3 (bidir, see 8)

### Nets
3V3: C130.2 C131.2 C132.2 C140.2 CR1.5(VBUS) CR2.5(VBUS) J7.P4(VDD) R150.2 R151.2 R152.2 R153.2 R154.2 R155.2 R156.2
GND: C130.1 C131.1 C132.1 C140.1 CR1.2(GND) CR2.2(GND) J7.G1(GND_2) J7.G2(GND_3) J7.G3(GND_4) J7.G4(GND) J7.P6(VSS)
SDMMC2_CD: J7.P9(DET) R156.1 ; port SDMMC2_CD
SDMMC2_CK: CR1.3(IO2) J7.P5(CLK) R154.1 ; port SDMMC2_CK
SDMMC2_CMD: CR2.6(IO4) J7.P3(CMD) R155.1 ; port SDMMC2_CMD
SDMMC2_D0: CR1.4(IO3) J7.P7(DAT0) R150.1 ; port SDMMC2_D0
SDMMC2_D1: CR1.6(IO4) J7.P8(DAT1) R151.1 ; port SDMMC2_D1
SDMMC2_D2: CR2.3(IO2) J7.P1(DAT2) R152.1 ; port SDMMC2_D2
SDMMC2_D3: CR2.4(IO3) J7.P2(CD/DAT3) R153.1 ; port SDMMC2_D3

Not connected (* = marked no-connect by the designer): CR1 1(IO1); CR2 1(IO1)

### Notes on the sheet
- Project:
- BEE-1012
- Sub-system:
- SATELLITE_EXP_CONTROLLER
- Design by:
- SANG HUYNH
- BAO BUI
- Sheet title:
- Sheet
- A3
- of
- Checked by:
- Approved by:
- VU PHAM
- Revision:
- Document No:
- Size:
- Date:

### Library data of the parts
C130-C132 C140 = _CAP_C_2: CAP CHIP
CR1 CR2 = IP4220CZ6,125: TVS DIODE 5.5VWM 6TSOP; Manufacturer_Name: Nexperia; Copyright: Copyright (C) 2025 Ultra Librarian. All rights reserved.; Manufacturer_Part_Number: IP4220CZ6,125; RefDes: RefDes; Type: Type
J7 = Molex_1051620001: 9 (8 + 1) Position Card Connector Secure Digital - microSDâ„¢ Surface Mount, Right Angle Gold; MF: Molex; SnapEDA_Link: https://www.snapeda.com/parts/1051620001/Molex/view-part/?ref=snap; Package: None; Value: *; MP: 1051620001; Check_prices: https://www.snapeda.com/parts/1051620001/Molex/view-part/?ref=eda
R150-R156 = _RES_B_2: RES

## Sheet eMMC.SchDoc
size 420 x 297 mm; SheetNumber: 11; SheetTotal: 23
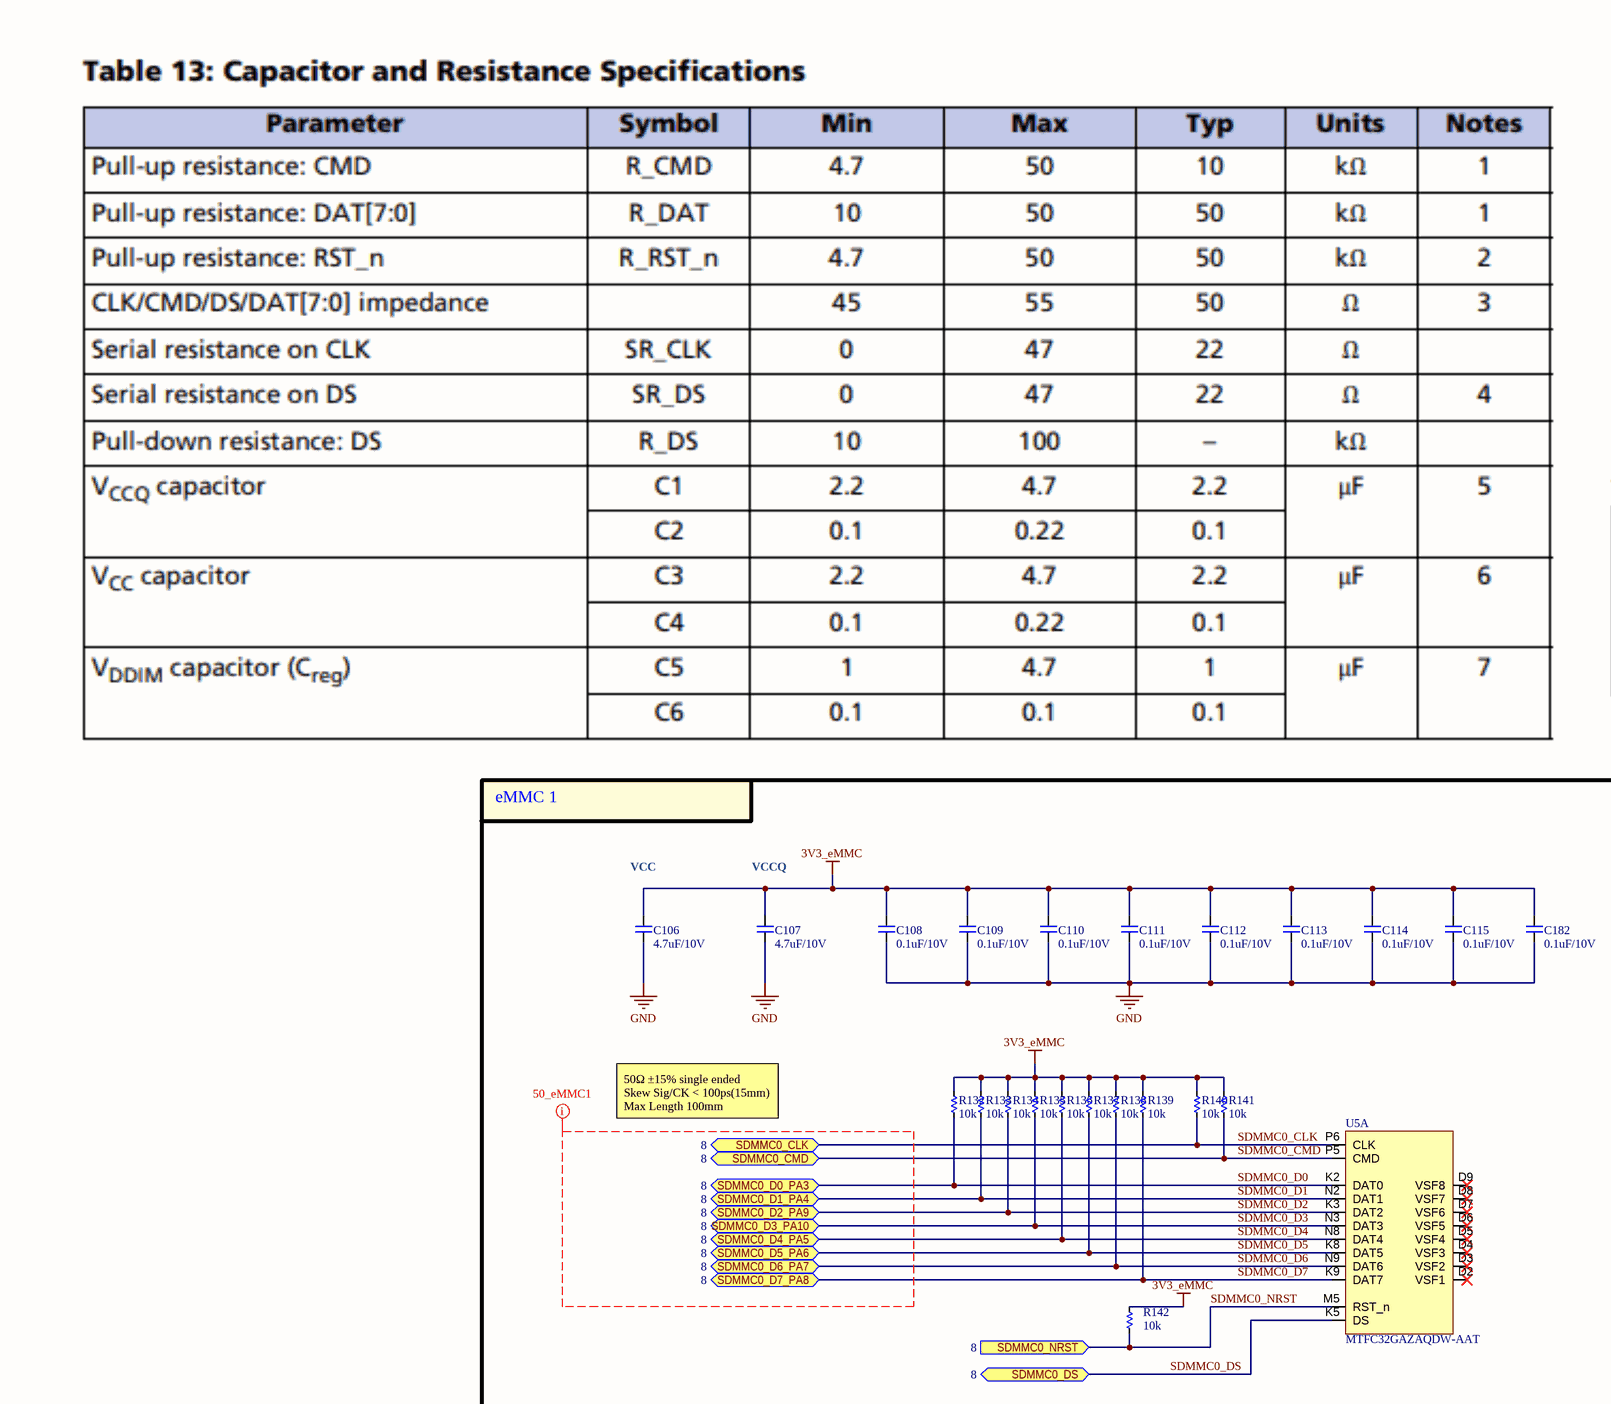
[diagram p11: eMMC.SchDoc, top left]
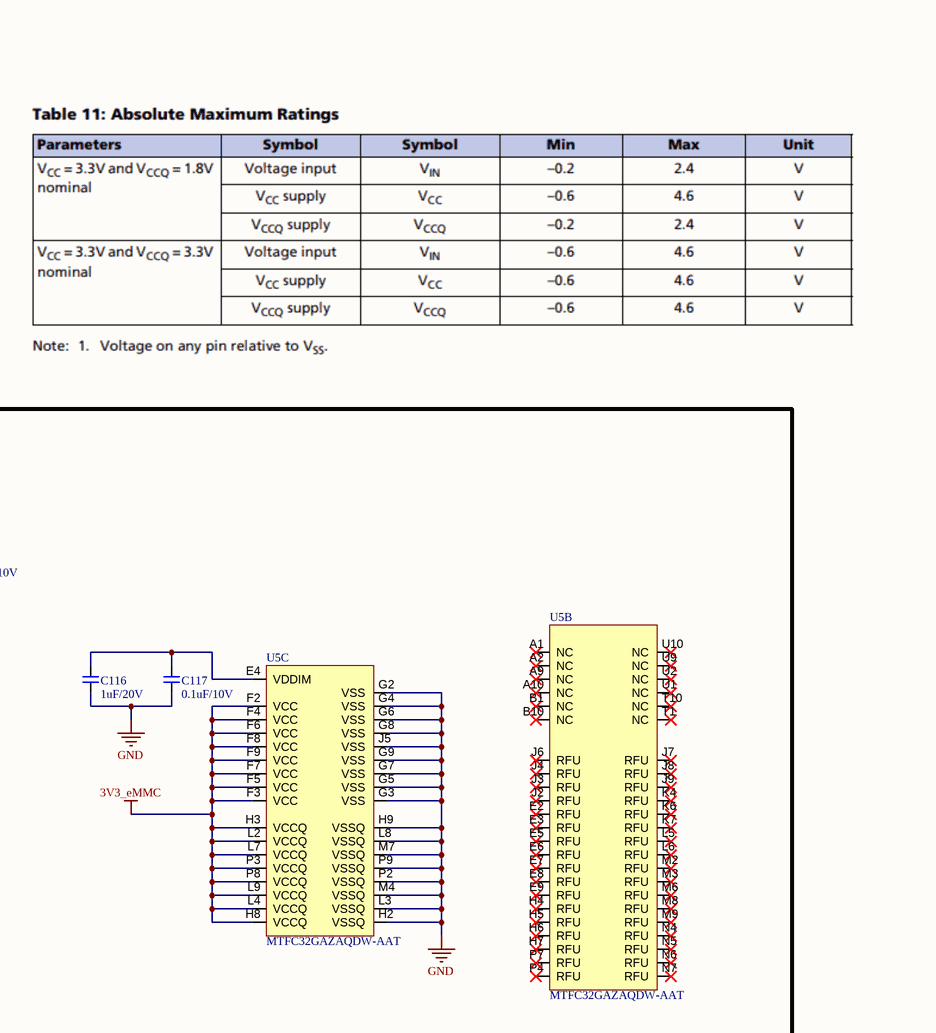
[diagram p12: eMMC.SchDoc, top middle]
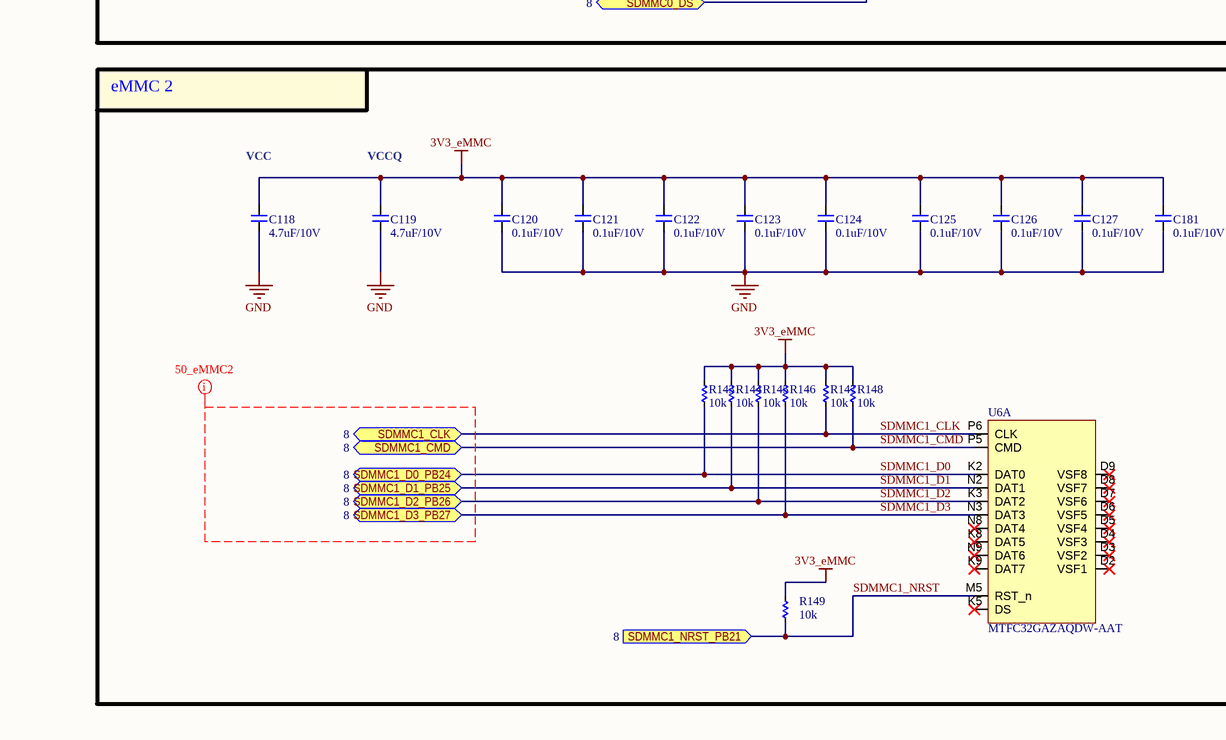
[diagram p13: eMMC.SchDoc, bottom left]
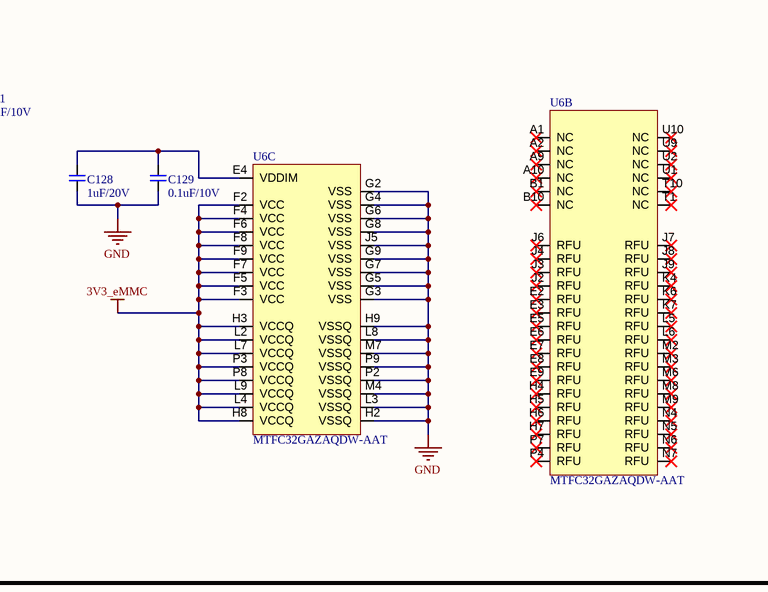
[diagram p14: eMMC.SchDoc, bottom middle]
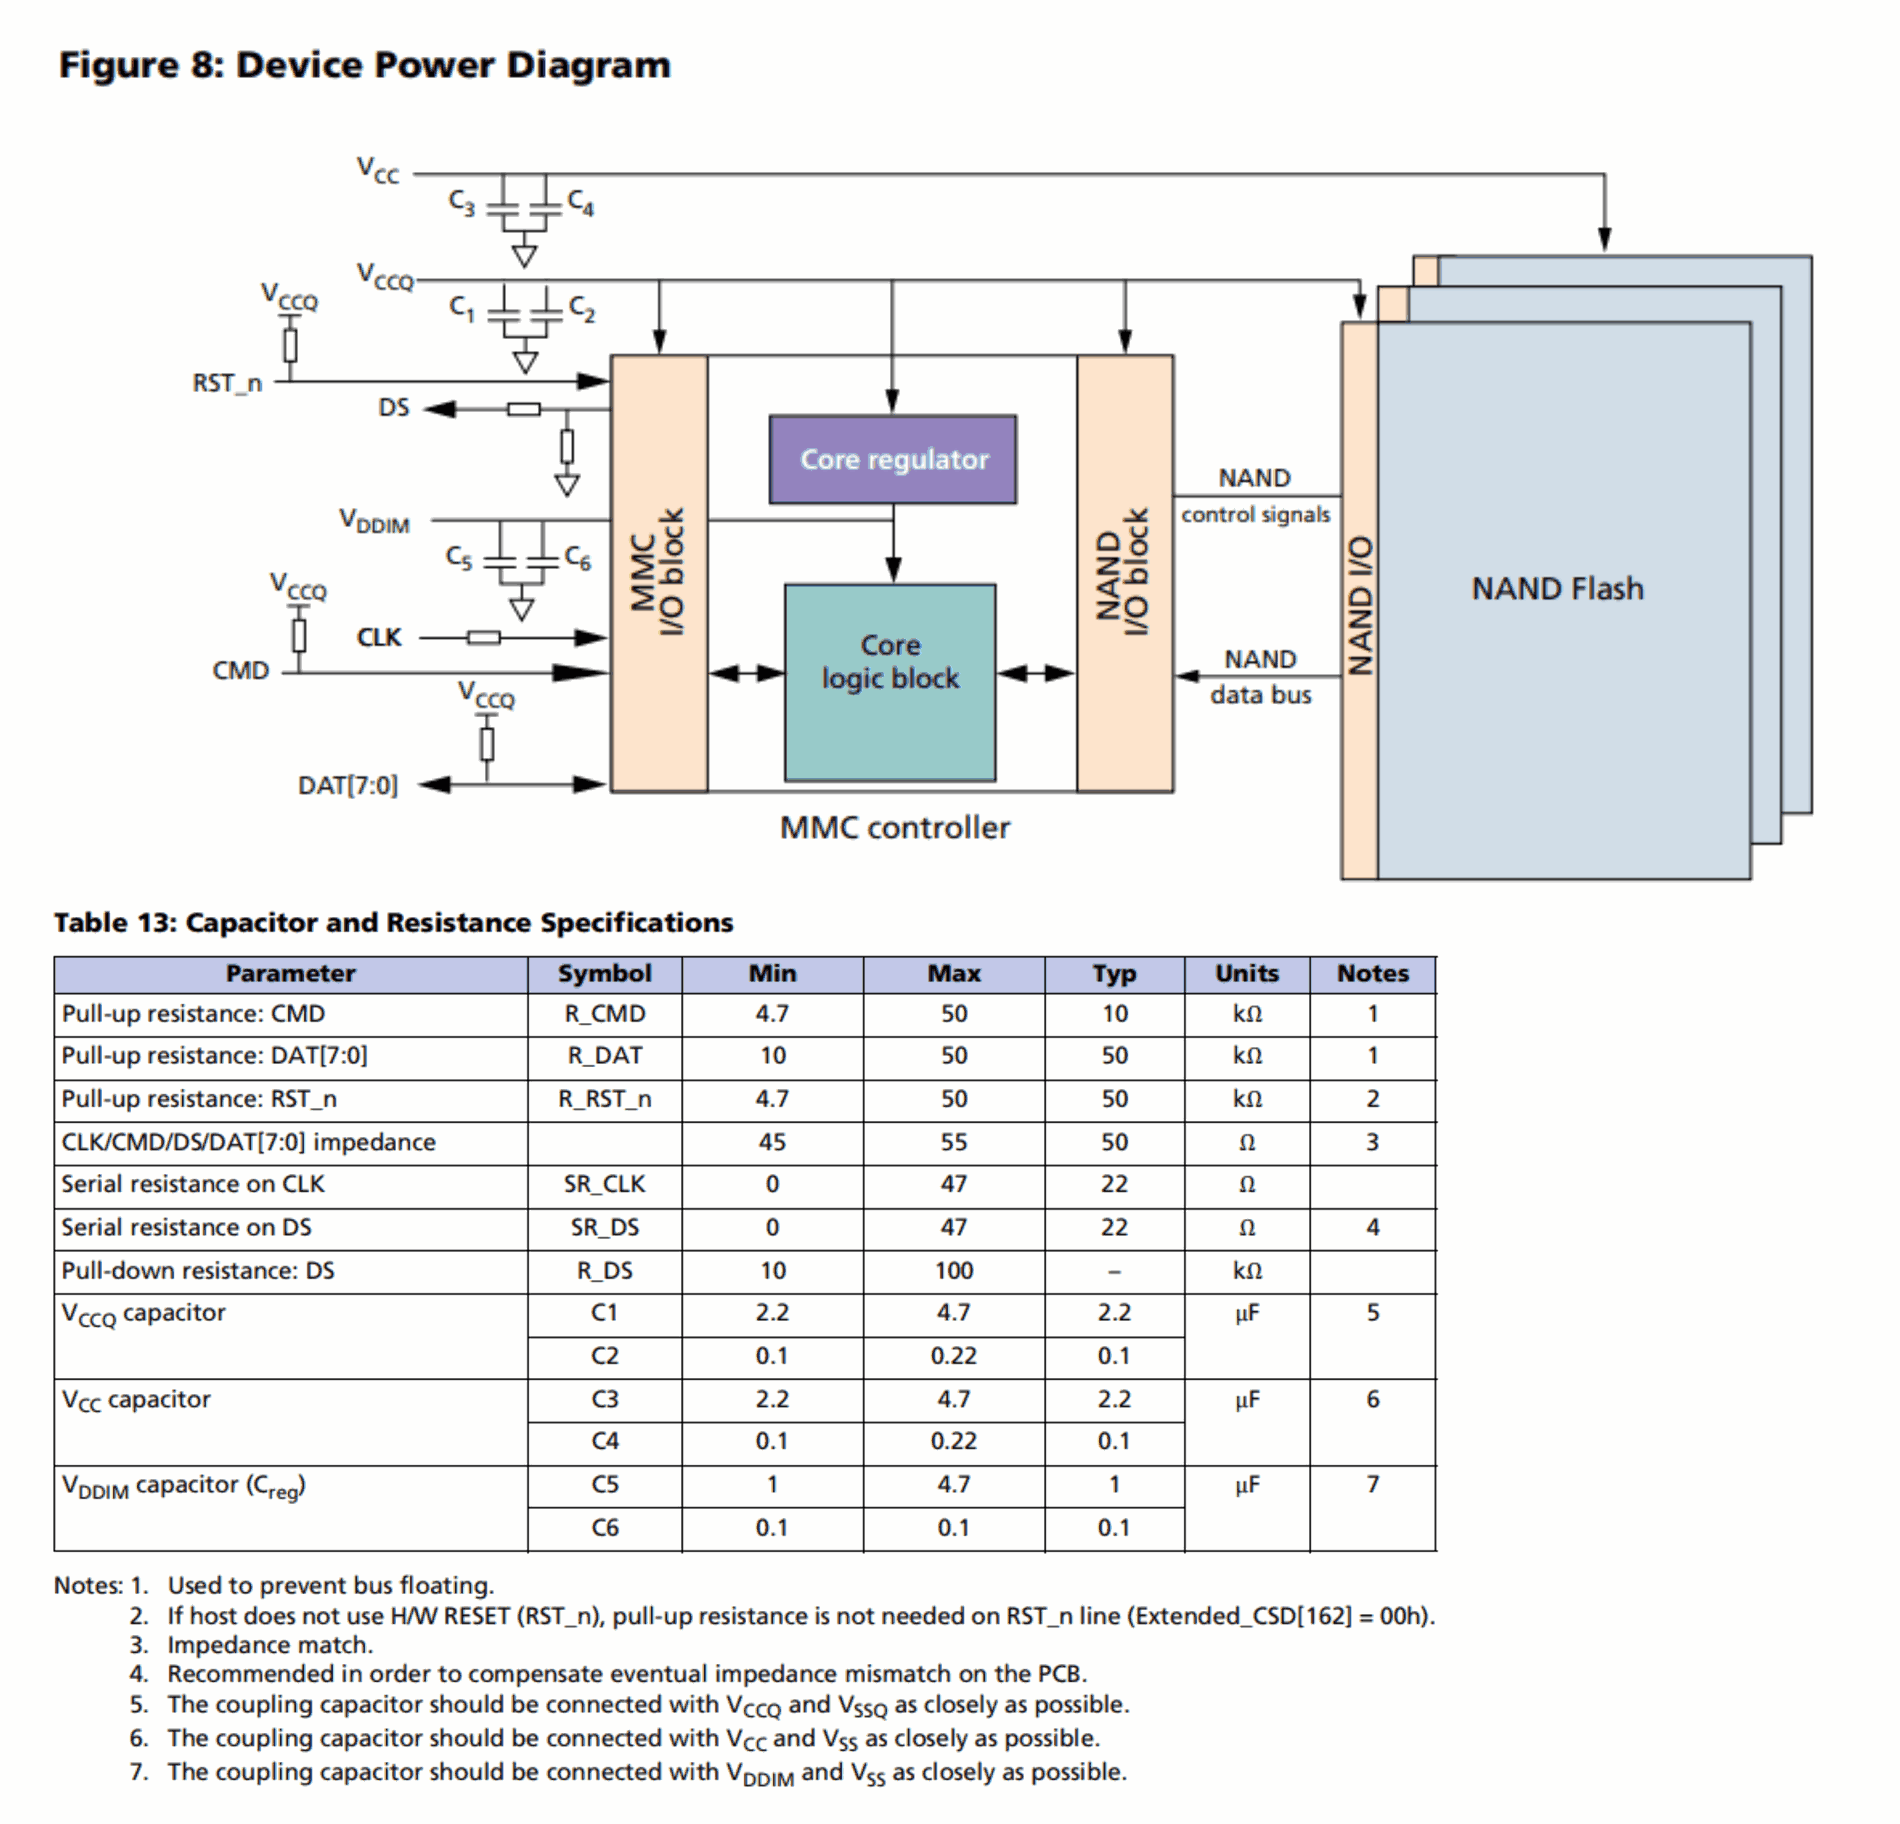
[diagram p15: eMMC.SchDoc, bottom right]

### Parts
C106  4.7uF/10V  [CAP_C_1005X50_L]
C107  4.7uF/10V  [CAP_C_1005X50_L]
C108  0.1uF/10V  [CAP_C_1005X50_L]
C109  0.1uF/10V  [CAP_C_1005X50_L]
C110  0.1uF/10V  [CAP_C_1005X50_L]
C111  0.1uF/10V  [CAP_C_1005X50_L]
C112  0.1uF/10V  [CAP_C_1005X50_L]
C113  0.1uF/10V  [CAP_C_1005X50_L]
C114  0.1uF/10V  [CAP_C_1005X50_L]
C115  0.1uF/10V  [CAP_C_1005X50_L]
C116  1uF/20V  [CAP_C_1005X50_L]
C117  0.1uF/10V  [CAP_C_1005X50_L]
C118  4.7uF/10V  [CAP_C_1005X50_L]
C119  4.7uF/10V  [CAP_C_1005X50_L]
C120  0.1uF/10V  [CAP_C_1005X50_L]
C121  0.1uF/10V  [CAP_C_1005X50_L]
C122  0.1uF/10V  [CAP_C_1005X50_L]
C123  0.1uF/10V  [CAP_C_1005X50_L]
C124  0.1uF/10V  [CAP_C_1005X50_L]
C125  0.1uF/10V  [CAP_C_1005X50_L]
C126  0.1uF/10V  [CAP_C_1005X50_L]
C127  0.1uF/10V  [CAP_C_1005X50_L]
C128  1uF/20V  [CAP_C_1005X50_L]
C129  0.1uF/10V  [CAP_C_1005X50_L]
C181  0.1uF/10V  [CAP_C_1005X50_L]
C182  0.1uF/10V  [CAP_C_1005X50_L]
R132  10k  [RES_C_1005x30_L]
R133  10k  [RES_C_1005x30_L]
R134  10k  [RES_C_1005x30_L]
R135  10k  [RES_C_1005x30_L]
R136  10k  [RES_C_1005x30_L]
R137  10k  [RES_C_1005x30_L]
R138  10k  [RES_C_1005x30_L]
R139  10k  [RES_C_1005x30_L]
R140  10k  [RES_C_1005x30_L]
R141  10k  [RES_C_1005x30_L]
R142  10k  [RES_C_1005x30_L]
R143  10k  [RES_C_1005x30_L]
R144  10k  [RES_C_1005x30_L]
R145  10k  [RES_C_1005x30_L]
R146  10k  [RES_C_1005x30_L]
R147  10k  [RES_C_1005x30_L]
R148  10k  [RES_C_1005x30_L]
R149  10k  [RES_C_1005x30_L]
U5  MTFC32GAZAQDW-AAT  [BGA_100_C_100P_10X17_1400X1800X150]  (parts A,B,C of 3)
U6  MTFC32GAZAQDW-AAT  [BGA_100_C_100P_10X17_1400X1800X150]  (parts A,B,C of 3)

### Blocks framed on the sheet
eMMC 1: C106-C117 C182 R132-R142 U5
eMMC 2: C118-C129 C181 R143-R149 U6

### Ports
SDMMC0_CLK (bidir, see 8), SDMMC0_CMD (bidir, see 8), SDMMC0_D0_PA3 (bidir, see 8), SDMMC0_D1_PA4 (bidir, see 8), SDMMC0_D2_PA9 (bidir, see 8), SDMMC0_D3_PA10 (bidir, see 8), SDMMC0_D4_PA5 (bidir, see 8), SDMMC0_D5_PA6 (bidir, see 8), SDMMC0_D6_PA7 (bidir, see 8), SDMMC0_D7_PA8 (bidir, see 8), SDMMC0_DS (bidir, see 8), SDMMC0_NRST (in, see 8), SDMMC1_CLK (bidir, see 8), SDMMC1_CMD (bidir, see 8), SDMMC1_D0_PB24 (bidir, see 8), SDMMC1_D1_PB25 (bidir, see 8), SDMMC1_D2_PB26 (bidir, see 8), SDMMC1_D3_PB27 (bidir, see 8), SDMMC1_NRST_PB21 (in, see 8)

### Nets
3V3_eMMC: C106.2 C107.2 C108.2 C109.2 C110.2 C111.2 C112.2 C113.2 C114.2 C115.2 C118.2 C119.2 C120.2 C121.2 C122.2 C123.2 C124.2 C125.2 C126.2 C127.2 C181.2 C182.2 R132.1 R133.1 R134.1 R135.1 R136.1 R137.1 R138.1 R139.1 R140.1 R141.1 R142.1 R143.1 R144.1 R145.1 R146.1 R147.1 R148.1 R149.1 U5.F2(VCC) U5.F3(VCC) U5.F4(VCC) U5.F5(VCC) U5.F6(VCC) U5.F7(VCC) U5.F8(VCC) U5.F9(VCC) U5.H3(VCCQ) U5.H8(VCCQ) U5.L2(VCCQ) U5.L4(VCCQ) U5.L7(VCCQ) U5.L9(VCCQ) U5.P3(VCCQ) U5.P8(VCCQ) U6.F2(VCC) U6.F3(VCC) U6.F4(VCC) U6.F5(VCC) U6.F6(VCC) U6.F7(VCC) U6.F8(VCC) U6.F9(VCC) U6.H3(VCCQ) U6.H8(VCCQ) U6.L2(VCCQ) U6.L4(VCCQ) U6.L7(VCCQ) U6.L9(VCCQ) U6.P3(VCCQ) U6.P8(VCCQ)
GND: C106.1 C107.1 C108.1 C109.1 C110.1 C111.1 C112.1 C113.1 C114.1 C115.1 C116.1 C117.1 C118.1 C119.1 C120.1 C121.1 C122.1 C123.1 C124.1 C125.1 C126.1 C127.1 C128.1 C129.1 C181.1 C182.1 U5.G2(VSS) U5.G3(VSS) U5.G4(VSS) U5.G5(VSS) U5.G6(VSS) U5.G7(VSS) U5.G8(VSS) U5.G9(VSS) U5.H2(VSSQ) U5.H9(VSSQ) U5.J5(VSS) U5.L3(VSSQ) U5.L8(VSSQ) U5.M4(VSSQ) U5.M7(VSSQ) U5.P2(VSSQ) U5.P9(VSSQ) U6.G2(VSS) U6.G3(VSS) U6.G4(VSS) U6.G5(VSS) U6.G6(VSS) U6.G7(VSS) U6.G8(VSS) U6.G9(VSS) U6.H2(VSSQ) U6.H9(VSSQ) U6.J5(VSS) U6.L3(VSSQ) U6.L8(VSSQ) U6.M4(VSSQ) U6.M7(VSSQ) U6.P2(VSSQ) U6.P9(VSSQ)
SDMMC0_CLK: R140.2 U5.P6(CLK) ; port SDMMC0_CLK
SDMMC0_CMD: R141.2 U5.P5(CMD) ; port SDMMC0_CMD
SDMMC0_D0: R132.2 U5.K2(DAT0) ; port SDMMC0_D0_PA3
SDMMC0_D1: R133.2 U5.N2(DAT1) ; port SDMMC0_D1_PA4
SDMMC0_D2: R134.2 U5.K3(DAT2) ; port SDMMC0_D2_PA9
SDMMC0_D3: R135.2 U5.N3(DAT3) ; port SDMMC0_D3_PA10
SDMMC0_D4: R136.2 U5.N8(DAT4) ; port SDMMC0_D4_PA5
SDMMC0_D5: R137.2 U5.K8(DAT5) ; port SDMMC0_D5_PA6
SDMMC0_D6: R138.2 U5.N9(DAT6) ; port SDMMC0_D6_PA7
SDMMC0_D7: R139.2 U5.K9(DAT7) ; port SDMMC0_D7_PA8
SDMMC0_DS: U5.K5(DS) ; port SDMMC0_DS
SDMMC0_NRST: R142.2 U5.M5(RST_n) ; port SDMMC0_NRST
SDMMC1_CLK: R147.2 U6.P6(CLK) ; port SDMMC1_CLK
SDMMC1_CMD: R148.2 U6.P5(CMD) ; port SDMMC1_CMD
SDMMC1_D0: R143.2 U6.K2(DAT0) ; port SDMMC1_D0_PB24
SDMMC1_D1: R144.2 U6.N2(DAT1) ; port SDMMC1_D1_PB25
SDMMC1_D2: R145.2 U6.K3(DAT2) ; port SDMMC1_D2_PB26
SDMMC1_D3: R146.2 U6.N3(DAT3) ; port SDMMC1_D3_PB27
SDMMC1_NRST: R149.2 U6.M5(RST_n) ; port SDMMC1_NRST_PB21
NetC116_2: C116.2 C117.2 U5.E4(VDDIM)
NetC128_2: C128.2 C129.2 U6.E4(VDDIM)

Not connected (* = marked no-connect by the designer): U5 A1(NC)* A2(NC)* A9(NC)* A10(NC)* B1(NC)* B10(NC)* D2(VSF1)* D3(VSF2)* D4(VSF3)* D5(VSF4)* D6(VSF5)* D7(VSF6)* D8(VSF7)* D9(VSF8)* E2(RFU)* E3(RFU)* E5(RFU)* E6(RFU)* E7(RFU)* E8(RFU)* E9(RFU)* H4(RFU)* H5(RFU)* H6(RFU)* H7(RFU)* J2(RFU)* J3(RFU)* J4(RFU)* J6(RFU)* J7(RFU)* J8(RFU)* J9(RFU)* K4(RFU)* K6(RFU)* K7(RFU)* L5(RFU)* L6(RFU)* M2(RFU)* M3(RFU)* M6(RFU)* M8(RFU)* M9(RFU)* N4(RFU)* N5(RFU)* N6(RFU)* N7(RFU)* P4(RFU)* P7(RFU)* T1(NC)* T10(NC)* U1(NC)* U2(NC)* U9(NC)* U10(NC)*; U6 A1(NC)* A2(NC)* A9(NC)* A10(NC)* B1(NC)* B10(NC)* D2(VSF1)* D3(VSF2)* D4(VSF3)* D5(VSF4)* D6(VSF5)* D7(VSF6)* D8(VSF7)* D9(VSF8)* E2(RFU)* E3(RFU)* E5(RFU)* E6(RFU)* E7(RFU)* E8(RFU)* E9(RFU)* H4(RFU)* H5(RFU)* H6(RFU)* H7(RFU)* J2(RFU)* J3(RFU)* J4(RFU)* J6(RFU)* J7(RFU)* J8(RFU)* J9(RFU)* K4(RFU)* K5(DS)* K6(RFU)* K7(RFU)* K8(DAT5)* K9(DAT7)* L5(RFU)* L6(RFU)* M2(RFU)* M3(RFU)* M6(RFU)* M8(RFU)* M9(RFU)* N4(RFU)* N5(RFU)* N6(RFU)* N7(RFU)* N8(DAT4)* N9(DAT6)* P4(RFU)* P7(RFU)* T1(NC)* T10(NC)* U1(NC)* U2(NC)* U9(NC)* U10(NC)*

### Layout directives
net class 50_eMMC1: (no net found under the mark)
net class 50_eMMC2: (no net found under the mark)

### Notes on the sheet
- (near C106) VCC
- (near C107) VCCQ
- 50Ω ±15% single ended
  Skew Sig/CK < 100ps(15mm)
  Max Length 100mm
- (near C118) VCC
- (near C119) VCCQ
- Project:
- BEE-1012
- Sub-system:
- SATELLITE_EXP_CONTROLLER
- Design by:
- SANG HUYNH
- BAO BUI
- Sheet title:
- Sheet
- A3
- of
- Checked by:
- Approved by:
- VU PHAM
- Revision:
- Document No:
- Size:
- Date:

### Library data of the parts
C106-C129 C181 C182 = _CAP_C_2: CAP CHIP
R132-R149 = _RES_B_2: RES

## Sheet EEPROM.SchDoc
size 420 x 297 mm; SheetNumber: 12; SheetTotal: 23
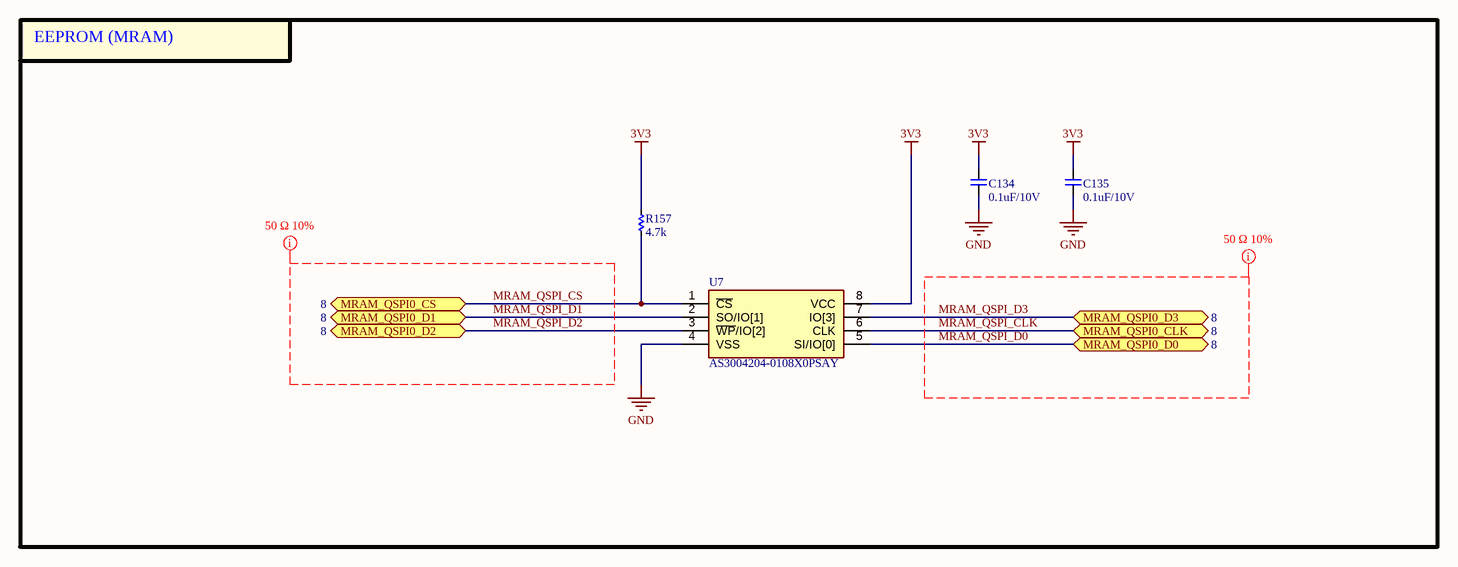
[diagram p16: EEPROM.SchDoc]

### Parts
C134  0.1uF/10V  [CAP_C_1005X50_L]
C135  0.1uF/10V  [CAP_C_1005X50_L]
R157  4.7k  [RES_C_1005x30_L]
U7  AS3004204-0108X0PSAY  [SOIC127P790X216-8N]

### Blocks framed on the sheet
EEPROM (MRAM): C134 C135 R157 U7

### Ports
MRAM_QSPI0_CLK (bidir, see 8), MRAM_QSPI0_CS (bidir, see 8), MRAM_QSPI0_D0 (bidir, see 8), MRAM_QSPI0_D1 (bidir, see 8), MRAM_QSPI0_D2 (bidir, see 8), MRAM_QSPI0_D3 (bidir, see 8)

### Nets
3V3: C134.2 C135.2 R157.1 U7.8(VCC)
GND: C134.1 C135.1 U7.4(VSS)
MRAM_QSPI_CLK: U7.6(CLK) ; port MRAM_QSPI0_CLK
MRAM_QSPI_CS: R157.2 U7.1(~{CS}) ; port MRAM_QSPI0_CS
MRAM_QSPI_D0: U7.5(SI/IO[0]) ; port MRAM_QSPI0_D0
MRAM_QSPI_D1: U7.2(SO/IO[1]) ; port MRAM_QSPI0_D1
MRAM_QSPI_D2: U7.3(~{WP}/IO[2]) ; port MRAM_QSPI0_D2
MRAM_QSPI_D3: U7.7(IO[3]) ; port MRAM_QSPI0_D3

### Layout directives
net class QSPI: MRAM_QSPI_CLK, MRAM_QSPI_CS, MRAM_QSPI_D0, MRAM_QSPI_D1, MRAM_QSPI_D2, MRAM_QSPI_D3

### Notes on the sheet
- Project:
- BEE-1012
- Sub-system:
- SATELLITE_EXP_CONTROLLER
- Design by:
- SANG HUYNH
- BAO BUI
- Sheet title:
- Sheet
- A3
- of
- Checked by:
- Approved by:
- VU PHAM
- Revision:
- Document No:
- Size:
- Date:

### Library data of the parts
C134 C135 = _CAP_C_2: CAP CHIP
R157 = _RES_B_2: RES
U7 = AS3004204-0108X0PSAY: MRAM Avalanche High Performance Serial P-SRAM 4Mb in SOIC8 package with QSPI - 108MHz interface, 3V, -40 C to 105 C; Manufacturer_Name: Avalanche Technology; Geometry.Height: 2.16mm; Manufacturer_Part_Number: AS3004204-0108X0PSAY; Mouser Part Number: 793-30042040108X0PSY; Mouser Price/Stock: https://www.mouser.co.uk/ProductDetail/Avalanche-Technology/AS3004204-0108X0PSAY/?qs=eP2BKZSCXI7G0ggegRejGg%3D%3D; Arrow Part Number: *; Arrow Price/Stock: *; Datasheet Link: https://www.mouser.ph/ProductDetail/Avalanche-Technology/AS3004204-0108X0PSAY?qs=eP2BKZSCXI7G0ggegRejGg%3D%3D

## Sheet USB_SWITCH.SchDoc
size 420 x 297 mm; SheetNumber: 13; SheetTotal: 23
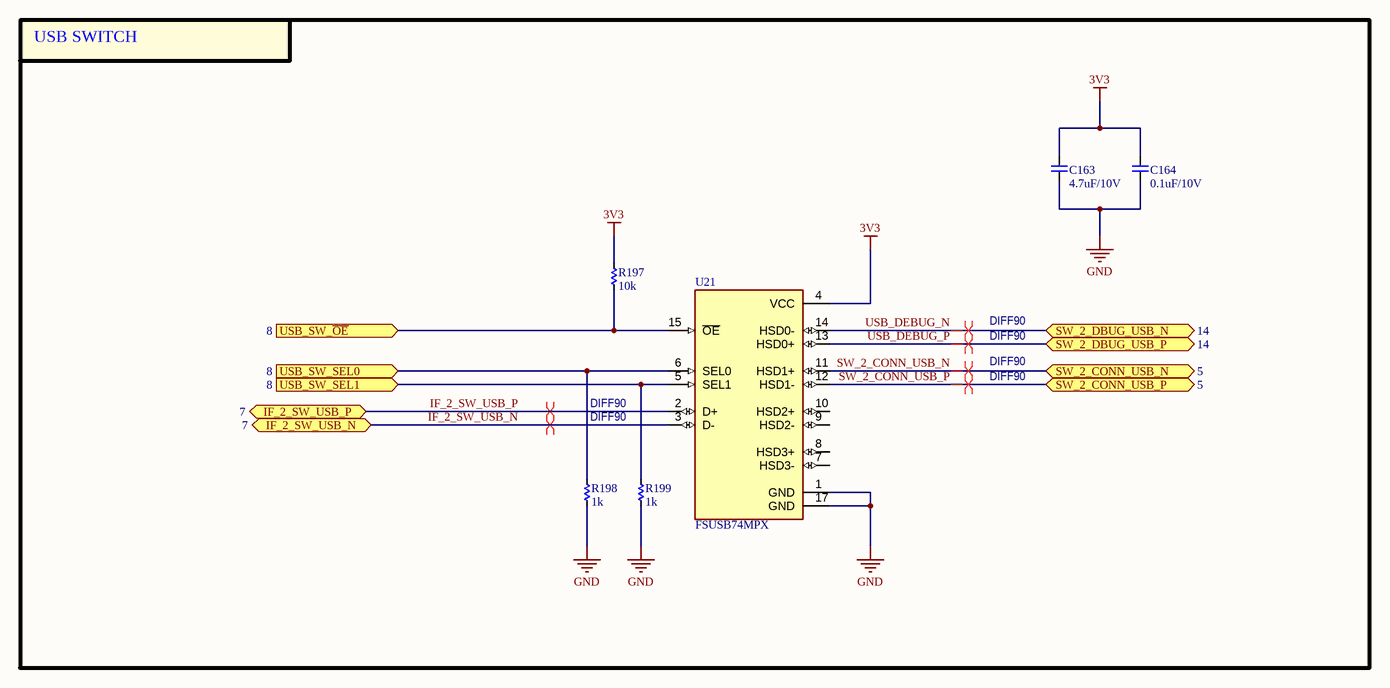
[diagram p17: USB_SWITCH.SchDoc]

### Parts
C163  4.7uF/10V  [CAP_C_1005X50_L]
C164  0.1uF/10V  [CAP_C_1005X50_L]
R197  10k  [RES_C_1005x30_L]
R198  1k  [RES_C_1005x30_L]
R199  1k  [RES_C_1005x30_L]
U21  FSUSB74MPX  [QFN50P300X300X80-17N]

### Blocks framed on the sheet
USB SWITCH: C163 C164 R197-R199 U21

### Ports
IF_2_SW_USB_N (bidir, see 7), IF_2_SW_USB_P (bidir, see 7), SW_2_CONN_USB_N (bidir, see 5), SW_2_CONN_USB_P (bidir, see 5), SW_2_DBUG_USB_N (bidir, see 14), SW_2_DBUG_USB_P (bidir, see 14), USB_SW_SEL0 (in, see 8), USB_SW_SEL1 (in, see 8), USB_SW_~{OE} (in, see 8)

### Nets
3V3: C163.2 C164.2 R197.2 U21.4(VCC)
GND: C163.1 C164.1 R198.1 R199.1 U21.1(GND) U21.17(GND)
IF_2_SW_USB_N: U21.3(D-) ; port IF_2_SW_USB_N
IF_2_SW_USB_P: U21.2(D+) ; port IF_2_SW_USB_P
SW_2_CONN_USB_N: U21.11(HSD1+) ; port SW_2_CONN_USB_N
SW_2_CONN_USB_P: U21.12(HSD1-) ; port SW_2_CONN_USB_P
USB_DEBUG_N: U21.14(HSD0-) ; port SW_2_DBUG_USB_N
USB_DEBUG_P: U21.13(HSD0+) ; port SW_2_DBUG_USB_P
NetR98_2: R197.1 U21.15(~{OE}) ; port USB_SW_~{OE}
NetR99_2: R198.2 U21.6(SEL0) ; port USB_SW_SEL0
NetR100_2: R199.2 U21.5(SEL1) ; port USB_SW_SEL1

Not connected (* = marked no-connect by the designer): U21 7(HSD3-) 8(HSD3+) 9(HSD2-) 10(HSD2+)

### Layout directives
differential pair; differential pair class DIFF90; net class DIFF90; rule Matched Net Lengths [Tolerance = 4mil]: IF_2_SW_USB_N, IF_2_SW_USB_P, SW_2_CONN_USB_N, SW_2_CONN_USB_P, USB_DEBUG_N, USB_DEBUG_P

### Notes on the sheet
- Project:
- BEE-1012
- Sub-system:
- SATELLITE_EXP_CONTROLLER
- Design by:
- SANG HUYNH
- BAO BUI
- Sheet title:
- Sheet
- A3
- of
- Checked by:
- Approved by:
- VU PHAM
- Revision:
- Document No:
- Size:
- Date:

### Library data of the parts
C163 C164 = _CAP_C_2: CAP CHIP
R197-R199 = _RES_B_2: RES
U21 = IC_USB_SW_FSUSB74MPX: USB Switch IC 1 Channel 16-MLP (3x3); MF: ON Semiconductor; SnapEDA_Link: https://www.snapeda.com/parts/FSUSB74MPX/Onsemi/view-part/?ref=snap; Package: WQFN-16 ON Semiconductor; Value: *; MP: FSUSB74MPX; Check_prices: https://www.snapeda.com/parts/FSUSB74MPX/Onsemi/view-part/?ref=eda

## Sheet DEBUG_CONSOLE.SchDoc
size 420 x 297 mm; SheetNumber: 14; SheetTotal: 23
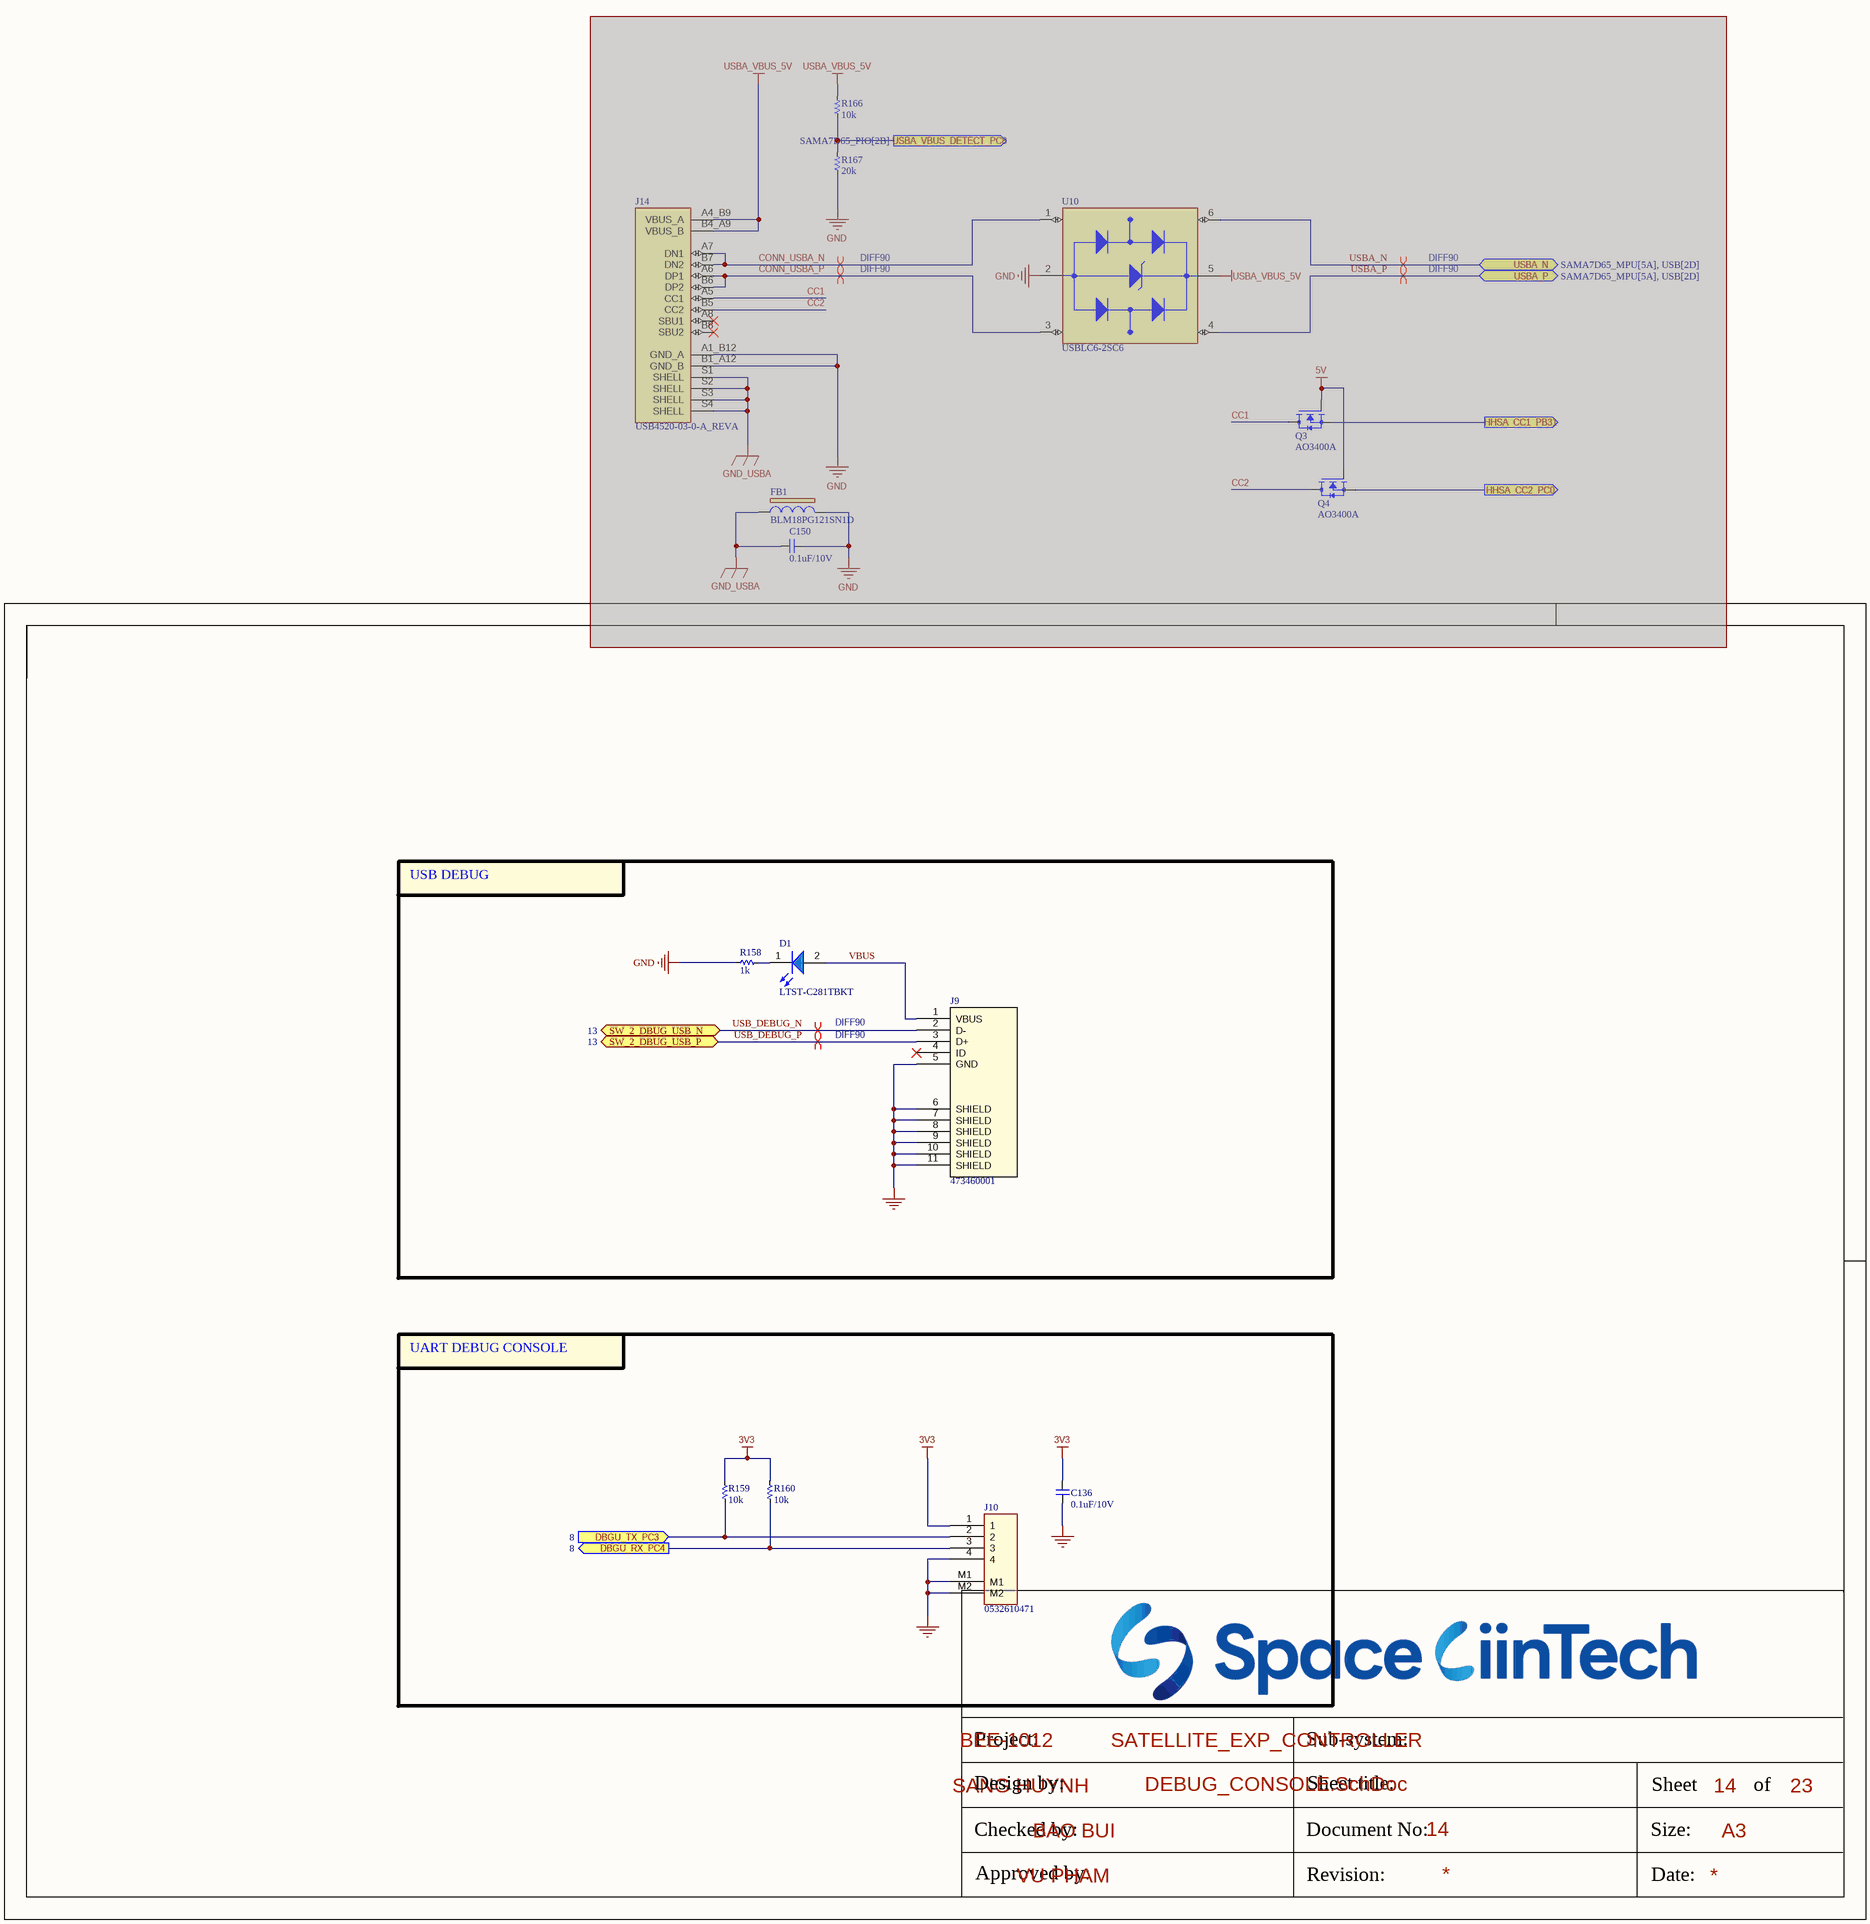
[diagram p18: DEBUG_CONSOLE.SchDoc]

### Parts
(Parts that share a designator on the sheet are numbered #1, #2 ... from top to bottom, then left to right.)
C136  0.1uF/10V  [CAP_C_1005X50_L]
C150#1  0.1uF/10V  [CAP_C_1005X50_L]  (masked out: inside a compile mask, not in the netlist)
D1  LTST-C281TBKT  [LED_0402]
FB1#2  BLM18PG121SN1D  [IND_BLM18_0603_MUR]  (masked out: inside a compile mask, not in the netlist)
J9  473460001  [47346-0001_MOL]
J10  0532610471  [MOLEX_0532610471]
J14#2  USB4520-03-0-A_REVA  [GCT_USB4520-03-0-A_REVA]  (masked out: inside a compile mask, not in the netlist)
Q3  AO3400A  [SOT95P280X125-3N]  (masked out: inside a compile mask, not in the netlist)
Q4  AO3400A  [SOT95P280X125-3N]  (masked out: inside a compile mask, not in the netlist)
R158  1k  [RES_C_1005x30_L]
R159  10k  [RES_C_1005x30_L]
R160  10k  [RES_C_1005x30_L]
R166#1  10k  [RES_C_1005x30_L]  (masked out: inside a compile mask, not in the netlist)
R167#1  20k  [RES_C_0603X30]  (masked out: inside a compile mask, not in the netlist)
U10  USBLC6-2SC6  [SOT95P280X145-6N]  (masked out: inside a compile mask, not in the netlist)

### Blocks framed on the sheet
USB DEBUG: D1 J9 R158
UART DEBUG CONSOLE: C136 J10 R159 R160

### Ports
DBGU_RX_PC4 (out, see 8), DBGU_TX_PC3 (in, see 8), HHSA_CC1_PB31 (out), HHSA_CC2_PC0 (out), SW_2_DBUG_USB_N (bidir, see 13), SW_2_DBUG_USB_P (bidir, see 13), USBA_N (bidir, see SAMA7D65_MPU[5A], USB[2D]), USBA_P (bidir, see SAMA7D65_MPU[5A], USB[2D]), USBA_VBUS_DETECT_PC8 (out, see SAMA7D65_PIO[2B])

### Nets
3V3: C136.2 J10.1 R159.1 R160.1
GND: C136.1 J9.5(GND) J9.6(SHIELD) J9.7(SHIELD) J9.8(SHIELD) J9.9(SHIELD) J9.10(SHIELD) J9.11(SHIELD) J10.4 J10.M1 J10.M2 R158.1
FLEXCOM9_UART_RX_DEBUG: J10.3 R160.2 ; port DBGU_RX_PC4
FLEXCOM9_UART_TX_DEBUG: J10.2 R159.2 ; port DBGU_TX_PC3
USB_DEBUG_N: J9.2(D-) ; port SW_2_DBUG_USB_N
USB_DEBUG_P: J9.3(D+) ; port SW_2_DBUG_USB_P
VBUS: D1.2(A) J9.1(VBUS)
NetD1_1: D1.1(K) R158.2

Not connected (* = marked no-connect by the designer): J9 4(ID)*

### Layout directives
differential pair; differential pair class DIFF90; net class DIFF90; rule Matched Net Lengths [Tolerance = 4mil]: (no net found under the mark), USB_DEBUG_N, USB_DEBUG_P

### Notes on the sheet
- Project:
- BEE-1012
- Sub-system:
- SATELLITE_EXP_CONTROLLER
- Design by:
- SANG HUYNH
- BAO BUI
- Sheet title:
- Sheet
- A3
- of
- Checked by:
- Approved by:
- VU PHAM
- Revision:
- Document No:
- Size:
- Date:

### Library data of the parts
C136 C150#1 = _CAP_C_2: CAP CHIP
D1 = LED_BLUE
FB1#2 = BLM18PG121SN1D: FERRITE BEAD 120 OHM 0603 1LN; Manufacturer_Name: Murata; Copyright: Copyright (C) 2025 Ultra Librarian. All rights reserved.; Manufacturer_Part_Number: BLM18PG121SN1D
J9 = 473460001: Micro-USB B Receptacle with Flange, Bottom Mount, Surface Mount, Lead-Free; Manufacturer_Name: Molex Connector Corporation; Copyright: Copyright (C) 2025 Ultra Librarian. All rights reserved.; Manufacturer_Part_Number: 473460001; RefDes: RefDes; Type: Type
J10 = Header 4x1_2M
J14#2 = USB4520-03-0-A_REVA: USB-C (USB TYPE-C) USB 2.0 Receptacle Connector 24 (16+8 Dummy) Position Board Edge, Cutout; Surface Mount; Through Hole, Right Angle; MF: Global Connector Technology; SnapEDA_Link: https://www.snapeda.com/parts/USB4520-03-0-A/Global+Connector+Technology/view-part/?ref=snap; Package: None; Value: *; MP: USB4520-03-0-A; Check_prices: https://www.snapeda.com/parts/USB4520-03-0-A/Global+Connector+Technology/view-part/?ref=eda
Q3 Q4 = AO3400A: N-Channel 30 V 5.7A (Ta) 1.4W (Ta) Surface Mount SOT-23-3; MF: Alpha & Omega Semiconductor; SnapEDA_Link: https://www.snapeda.com/parts/AO3400A/Alpha/view-part/?ref=snap; Package: SOT-23 Alpha &amp; Omega Semiconductor Inc.; Value: *; MP: AO3400A; Check_prices: https://www.snapeda.com/parts/AO3400A/Alpha/view-part/?ref=eda
R158-R160 R166#1 R167#1 = _RES_B_2: RES
U10 = USBLC6-2SC6: 17V Clamp 5A (8/20Âµs) Ipp Tvs Diode Surface Mount SOT-23-6; MF: STMicroelectronics; Value: *; SnapEDA_Link: https://www.snapeda.com/parts/USBLC6-2SC6/STMicroelectronics/view-part/?ref=snap; Check_prices: https://www.snapeda.com/parts/USBLC6-2SC6/STMicroelectronics/view-part/?ref=eda; Purchase-URL: https://pricing.snapeda.com/search/part/USBLC6-2SC6/?ref=eda; Price: None; Availability: In Stock; Package: SOT-23-6 STMicroelectronics; MP: USBLC6-2SC6

## Sheet TEMP.SchDoc
size 420 x 297 mm; SheetNumber: 15; SheetTotal: 23
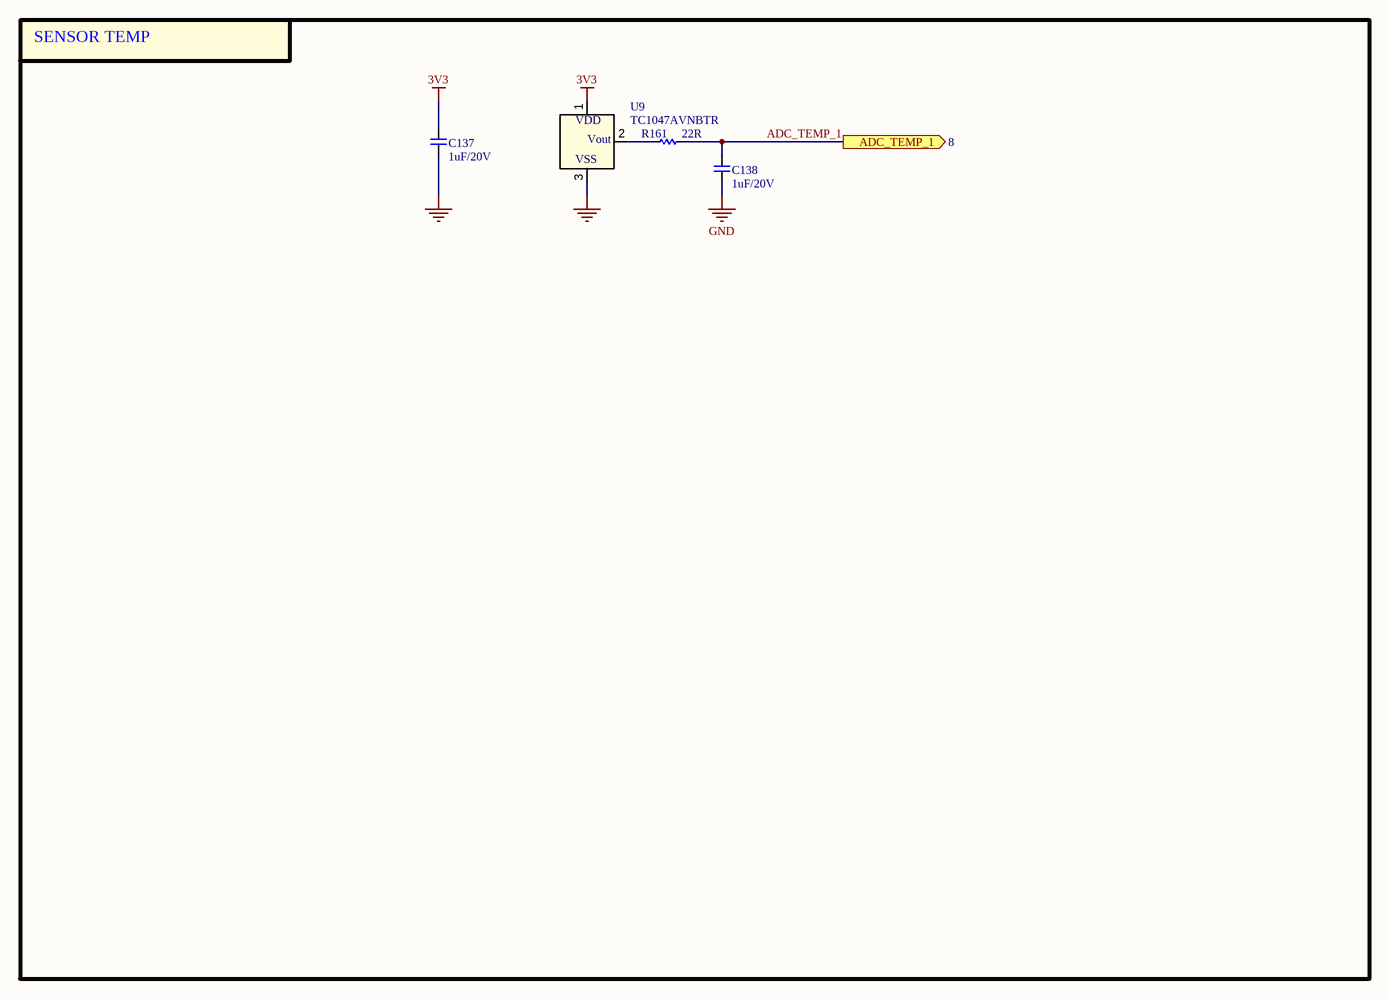
[diagram p19: TEMP.SchDoc]

### Parts
C137  1uF/20V  [CAP_C_1005X50_L]
C138  1uF/20V  [CAP_C_1005X50_L]
R161  22R  [RES_C_1005x30_L]
U9  TC1047AVNBTR  [SOT-23_MC_MCH]

### Blocks framed on the sheet
SENSOR TEMP: C137 C138 R161 U9

### Ports
ADC_TEMP_1 (out, see 8)

### Nets
3V3: C137.2 U9.1(VDD)
GND: C137.1 C138.1 U9.3(VSS)
ADC_TEMP_1: C138.2 R161.2 ; port ADC_TEMP_1
NetR161_1: R161.1 U9.2(VOUT)

### Notes on the sheet
- Project:
- BEE-1012
- Sub-system:
- SATELLITE_EXP_CONTROLLER
- Design by:
- SANG HUYNH
- BAO BUI
- Sheet title:
- Sheet
- A3
- of
- Checked by:
- Approved by:
- VU PHAM
- Revision:
- Document No:
- Size:
- Date:
- (in symbol TC1047AVNBTR) Vout

### Library data of the parts
C137 C138 = _CAP_C_2: CAP CHIP
R161 = _RES_B_2: RES
U9 = TC1047AVNBTR: SENSOR ANALOG -40C-125C SOT23-3; Manufacturer_Name: Microchip; Copyright: Copyright (C) 2025 Ultra Librarian. All rights reserved.; Manufacturer_Part_Number: TC1047AVNBTR; RefDes: RefDes; Type: Type

## Sheet RTC.SchDoc
size 420 x 297 mm; SheetNumber: 16; SheetTotal: 23
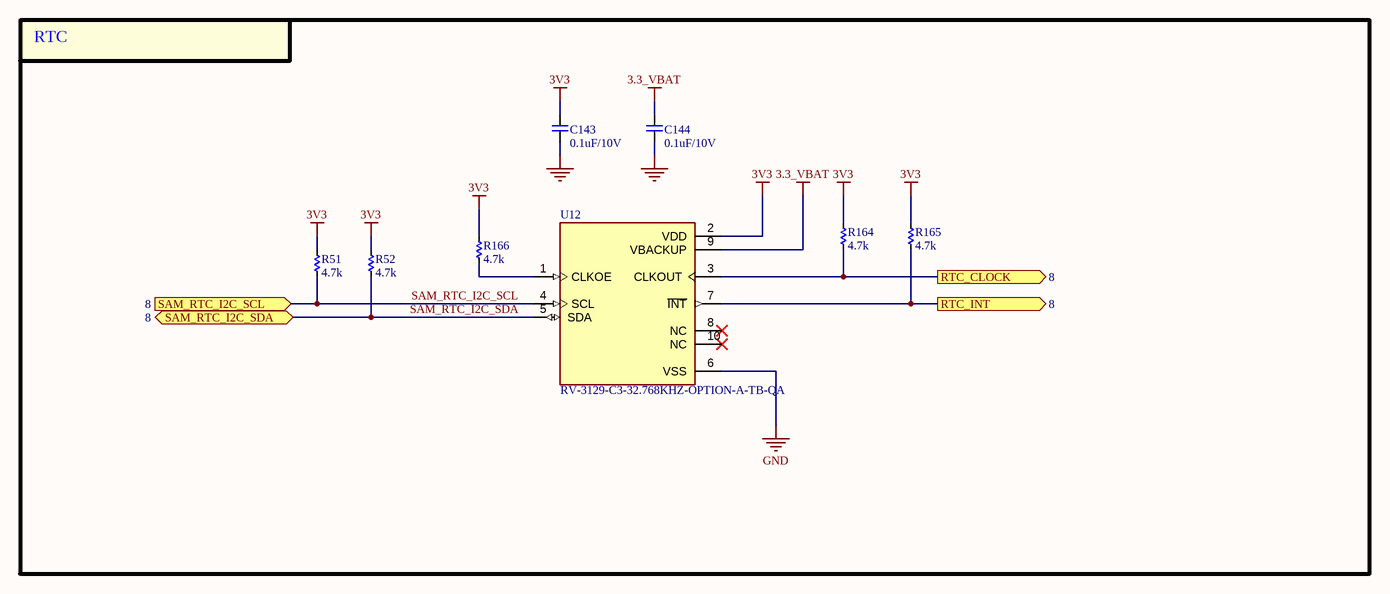
[diagram p20: RTC.SchDoc]

### Parts
(Parts that share a designator on the sheet are numbered #1, #2 ... from top to bottom, then left to right.)
C143  0.1uF/10V  [CAP_C_1005X50_L]
C144  0.1uF/10V  [CAP_C_1005X50_L]
R51  4.7k  [RES_C_1005x30_L]
R52  4.7k  [RES_C_1005x30_L]
R164  4.7k  [RES_C_1005x30_L]
R165  4.7k  [RES_C_1005x30_L]
R166#2  4.7k  [RES_C_1005x30_L]
U12  RV-3129-C3-32.768KHZ-OPTION-A-TB-QA  [IC_RV-3129-C3-32.768KHZ-OPTION-A-TB-QA]

### Blocks framed on the sheet
RTC: C143 C144 R51 R52 R164 R165 R166#2 U12

### Ports
RTC_CLOCK (out, see 8), RTC_INT (out, see 8), SAM_RTC_I2C_SCL (in, see 8), SAM_RTC_I2C_SDA (bidir, see 8)

### Nets
3.3_VBAT: C144.2 U12.9(VBACKUP)
3V3: C143.2 R51.1 R52.1 R164.1 R165.1 R166#2.1 U12.2(VDD)
GND: C143.1 C144.1 U12.6(VSS)
SAM_RTC_I2C_SCL: R51.2 U12.4(SCL) ; port SAM_RTC_I2C_SCL  [project net FLEXCOM10_I2C_SCL]
SAM_RTC_I2C_SDA: R52.2 U12.5(SDA) ; port SAM_RTC_I2C_SDA  [project net FLEXCOM10_I2C_SDA]
NetR96_2: R164.2 U12.3(CLKOUT) ; port RTC_CLOCK
NetR125_2: R165.2 U12.7(~{INT}) ; port RTC_INT
NetR166#2_2: R166#2.2 U12.1(CLKOE)

Not connected (* = marked no-connect by the designer): U12 8(NC)* 10(NC)*

### Notes on the sheet
- Project:
- BEE-1012
- Sub-system:
- SATELLITE_EXP_CONTROLLER
- Design by:
- SANG HUYNH
- BAO BUI
- Sheet title:
- Sheet
- A3
- of
- Checked by:
- Approved by:
- VU PHAM
- Revision:
- Document No:
- Size:
- Date:

### Library data of the parts
C143 C144 = _CAP_C_2: CAP CHIP
R51 R52 R164 R165 R166#2 = _RES_B_2: RES
U12 = RV-3129-C3-32.768KHZ-OPTION-A-TB-QA: Real-Time Clock Module with I2C-Bus; MP: RV-3129-C3-32.768KHZ-OPTION-A-TB-QA; Value: *; Price: None; Package: None; Availability: Unavailable

## Sheet WATCHDOG.SchDoc
size 420 x 297 mm; SheetNumber: 17; SheetTotal: 23
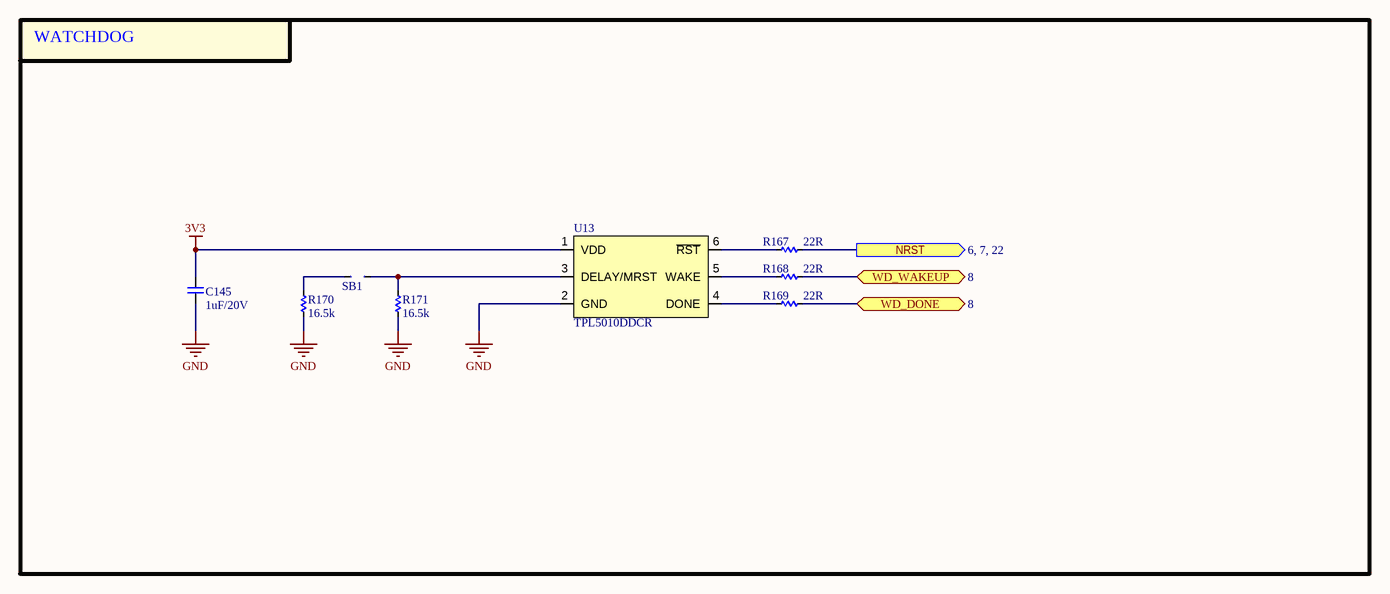
[diagram p21: WATCHDOG.SchDoc]

### Parts
(Parts that share a designator on the sheet are numbered #1, #2 ... from top to bottom, then left to right.)
C145  1uF/20V  [CAP_C_1005X50_L]
R167#2  22R  [RES_C_1005x30_L]
R168  22R  [RES_C_1005x30_L]
R169  22R  [RES_C_1005x30_L]
R170  16.5k  [RES_C_1005x30_L]
R171  16.5k  [RES_C_1005x30_L]
SB1  JUMPER  [JUMPER_1608]  (value not drawn)
U13  TPL5010DDCR  [TPL5010DDCR]

### Blocks framed on the sheet
WATCHDOG: C145 R167#2 R168-R171 SB1 U13

### Ports
NRST (out, see 6, 7, 22), WD_DONE (bidir, see 8), WD_WAKEUP (bidir, see 8)

### Nets
3V3: C145.2 U13.1(VDD)
GND: C145.1 R170.2 R171.2 U13.2(GND)
NRST: R167#2.2 ; port NRST
NetR67_2: R169.2 ; port WD_DONE
NetR126_2: R168.2 ; port WD_WAKEUP
NetR167#2_1: R167#2.1 U13.6(~{RST})
NetR168_1: R168.1 U13.5(WAKE)
NetR169_1: R169.1 U13.4(DONE)
NetR170_1: R170.1 SB1.1
NetR171_1: R171.1 SB1.2 U13.3(DELAY/MRST)

### Notes on the sheet
- Project:
- BEE-1012
- Sub-system:
- SATELLITE_EXP_CONTROLLER
- Design by:
- SANG HUYNH
- BAO BUI
- Sheet title:
- Sheet
- A3
- of
- Checked by:
- Approved by:
- VU PHAM
- Revision:
- Document No:
- Size:
- Date:

### Library data of the parts
C145 = _CAP_C_2: CAP CHIP
R167#2 R168-R171 = _RES_B_2: RES
U13 = TPL5010DDCR: OSC PROG TIMER TSOT23-6

## Sheet LVDS.SchDoc
size 420 x 297 mm; SheetNumber: 18; SheetTotal: 23
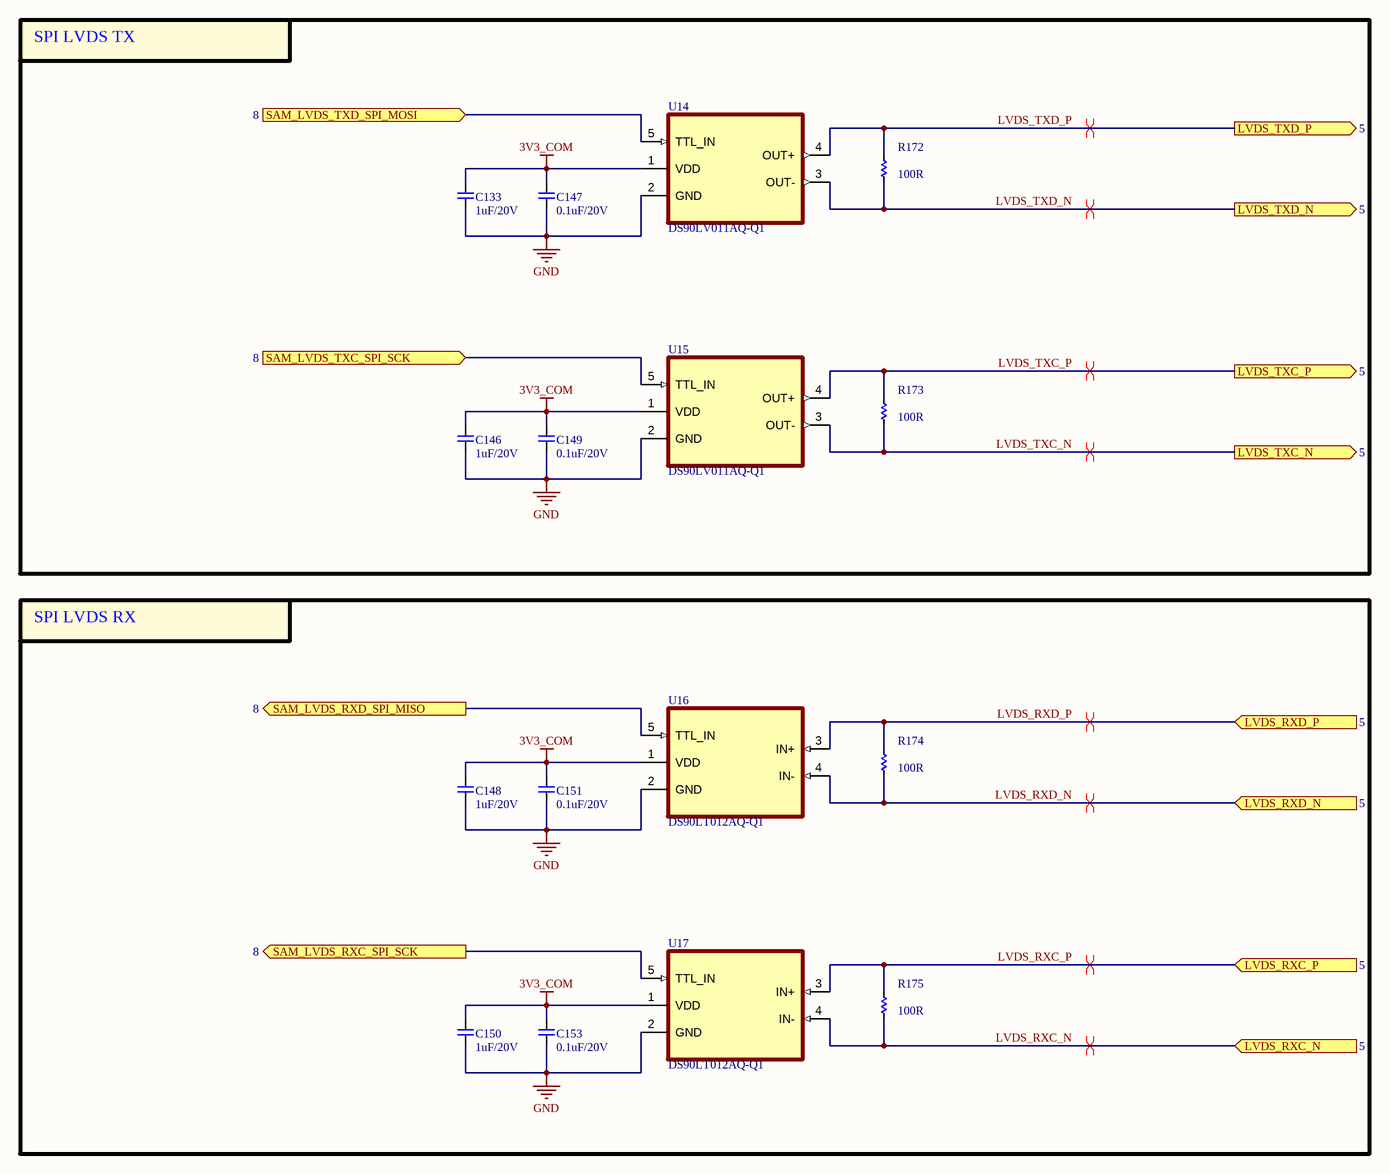
[diagram p22: LVDS.SchDoc]

### Parts
(Parts that share a designator on the sheet are numbered #1, #2 ... from top to bottom, then left to right.)
C133  1uF/20V  [CAP_C_1005X50_L]
C146  1uF/20V  [CAP_C_1005X50_L]
C147  0.1uF/20V  [CAP_C_1005X50_L]
C148  1uF/20V  [CAP_C_1005X50_L]
C149  0.1uF/20V  [CAP_C_1005X50_L]
C150#2  1uF/20V  [CAP_C_1005X50_L]
C151  0.1uF/20V  [CAP_C_1005X50_L]
C153  0.1uF/20V  [CAP_C_1005X50_L]
R172  100R  [RES_C_1005x30_L]
R173  100R  [RES_C_1005x30_L]
R174  100R  [RES_C_1005x30_L]
R175  100R  [RES_C_1005x30_L]
U14  DS90LV011AQ-Q1  [DS90LV011AQ-Q1]
U15  DS90LV011AQ-Q1  [DS90LV011AQ-Q1]
U16  DS90LT012AQ-Q1  [DS90LV011AQ-Q1]
U17  DS90LT012AQ-Q1  [DS90LV011AQ-Q1]

### Blocks framed on the sheet
SPI LVDS TX: C133 C146 C147 C149 R172 R173 U14 U15
SPI LVDS RX: C148 C150#2 C151 C153 R174 R175 U16 U17

### Ports
LVDS_RXC_N (in, see 5), LVDS_RXC_P (in, see 5), LVDS_RXD_N (in, see 5), LVDS_RXD_P (in, see 5), LVDS_TXC_N (out, see 5), LVDS_TXC_P (out, see 5), LVDS_TXD_N (out, see 5), LVDS_TXD_P (out, see 5), SAM_LVDS_RXC_SPI_SCK (out, see 8), SAM_LVDS_RXD_SPI_MISO (out, see 8), SAM_LVDS_TXC_SPI_SCK (in, see 8), SAM_LVDS_TXD_SPI_MOSI (in, see 8)

### Nets
3V3_COM: C133.2 C146.2 C147.2 C148.2 C149.2 C150#2.2 C151.2 C153.2 U14.1(VDD) U15.1(VDD) U16.1(VDD) U17.1(VDD)
GND: C133.1 C146.1 C147.1 C148.1 C149.1 C150#2.1 C151.1 C153.1 U14.2(GND) U15.2(GND) U16.2(GND) U17.2(GND)
FLEXCOM2_SPI_CLK: U17.5(TTL_IN) ; port SAM_LVDS_RXC_SPI_SCK
FLEXCOM2_SPI_MISO: U16.5(TTL_IN) ; port SAM_LVDS_RXD_SPI_MISO
FLEXCOM8_SPI_CK: U15.5(TTL_IN) ; port SAM_LVDS_TXC_SPI_SCK
FLEXCOM8_SPI_MOSI: U14.5(TTL_IN) ; port SAM_LVDS_TXD_SPI_MOSI
LVDS_RXC_N: R175.2 U17.4(IN-) ; port LVDS_RXC_N
LVDS_RXC_P: R175.1 U17.3(IN+) ; port LVDS_RXC_P
LVDS_RXD_N: R174.2 U16.4(IN-) ; port LVDS_RXD_N
LVDS_RXD_P: R174.1 U16.3(IN+) ; port LVDS_RXD_P
LVDS_TXC_N: R173.2 U15.3(OUT-) ; port LVDS_TXC_N
LVDS_TXC_P: R173.1 U15.4(OUT+) ; port LVDS_TXC_P
LVDS_TXD_N: R172.2 U14.3(OUT-) ; port LVDS_TXD_N
LVDS_TXD_P: R172.1 U14.4(OUT+) ; port LVDS_TXD_P

### Layout directives
differential pair: LVDS_RXC_N, LVDS_RXC_P, LVDS_RXD_N, LVDS_RXD_P, LVDS_TXC_N, LVDS_TXC_P, LVDS_TXD_N, LVDS_TXD_P

### Notes on the sheet
- Project:
- BEE-1012
- Sub-system:
- SATELLITE_EXP_CONTROLLER
- Design by:
- SANG HUYNH
- BAO BUI
- Sheet title:
- Sheet
- A3
- of
- Checked by:
- Approved by:
- VU PHAM
- Revision:
- Document No:
- Size:
- Date:

### Library data of the parts
C133 C146-C149 C150#2 C151 C153 = _CAP_C_2: CAP CHIP
R172-R175 = _RES_B_2: RES
U14 U15 = DS90LV011AQ-Q1: Automotive LVDS Differential Driver
U16 U17 = DS90LT012AQ-Q1: Automotive LVDS Differential Line Receiver

## Sheet CAN_PHY.SchDoc
size 420 x 297 mm; SheetNumber: 19; SheetTotal: 23
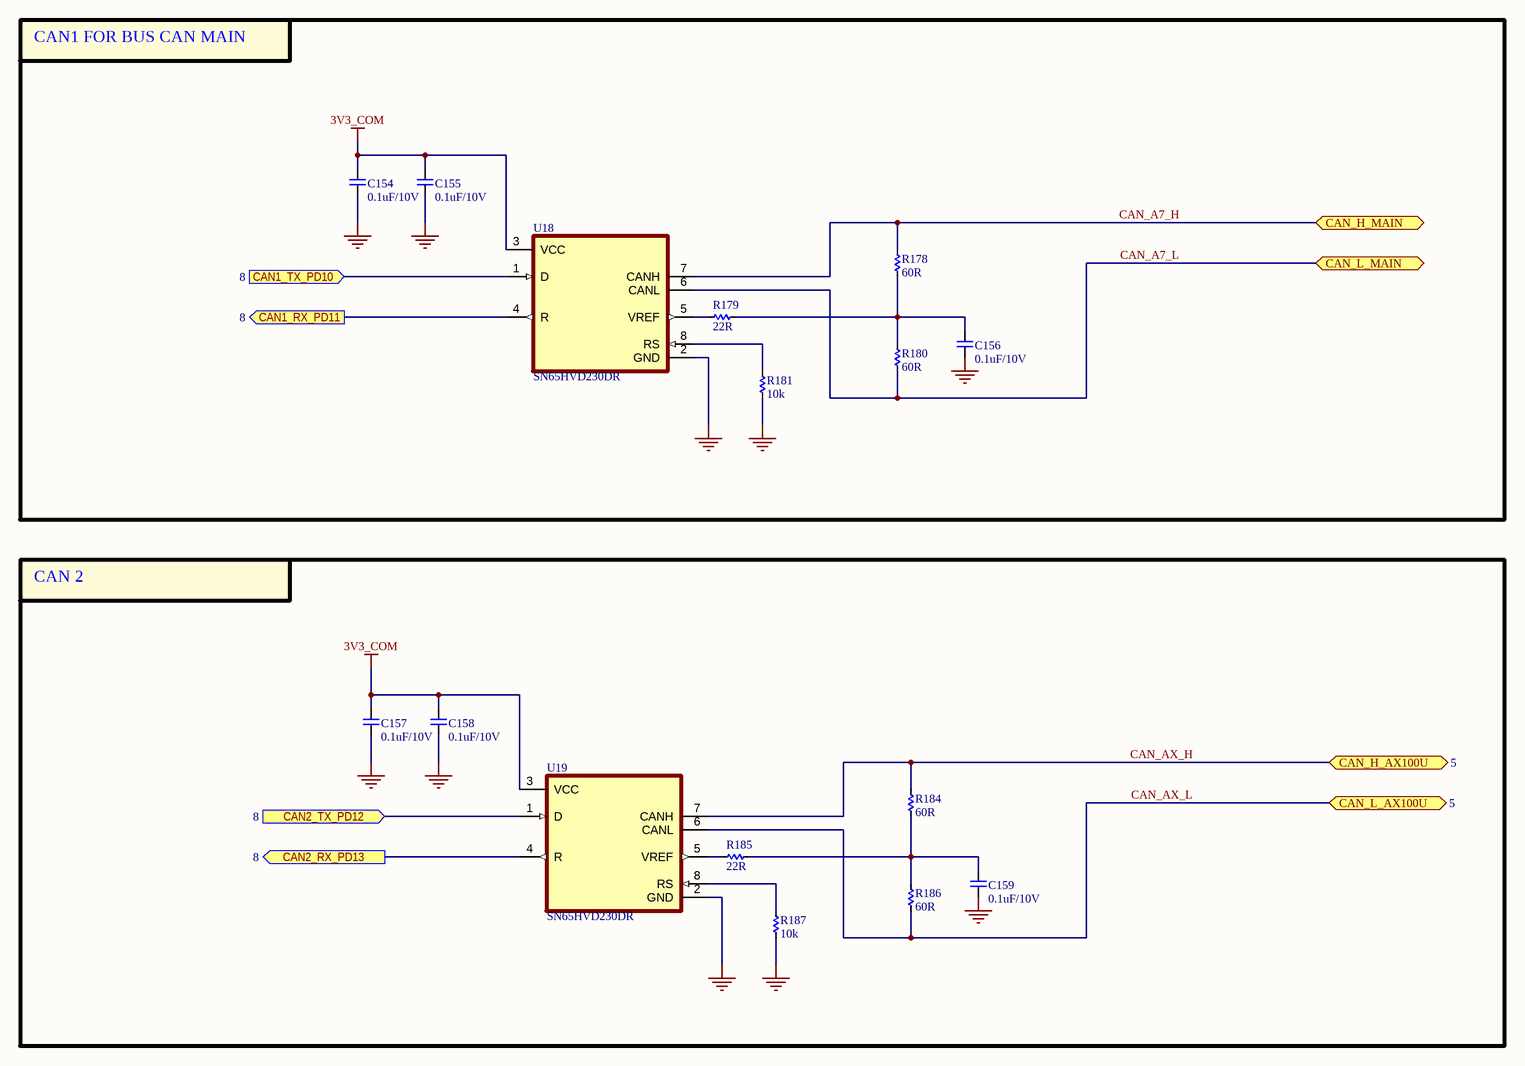
[diagram p23: CAN_PHY.SchDoc]

### Parts
C154  0.1uF/10V  [CAP_C_1005X50_L]
C155  0.1uF/10V  [CAP_C_1005X50_L]
C156  0.1uF/10V  [CAP_C_1005X50_L]
C157  0.1uF/10V  [CAP_C_1005X50_L]
C158  0.1uF/10V  [CAP_C_1005X50_L]
C159  0.1uF/10V  [CAP_C_1005X50_L]
R178  60R  [RES_C_1005x30_L]
R179  22R  [RES_C_1005x30_L]
R180  60R  [RES_C_1005x30_L]
R181  10k  [RES_C_1005x30_L]
R184  60R  [RES_C_1005x30_L]
R185  22R  [RES_C_1005x30_L]
R186  60R  [RES_C_1005x30_L]
R187  10k  [RES_C_1005x30_L]
U18  SN65HVD230DR  [SOIC127P599X175-8N]
U19  SN65HVD230DR  [SOIC127P599X175-8N]

### Blocks framed on the sheet
CAN1 FOR BUS CAN MAIN: C154-C156 R178-R181 U18
CAN 2: C157-C159 R184-R187 U19

### Ports
CAN1_RX_PD11 (out, see 8), CAN1_TX_PD10 (in, see 8), CAN2_RX_PD13 (out, see 8), CAN2_TX_PD12 (in, see 8), CAN_H_AX100U (bidir, see 5), CAN_H_MAIN (bidir, see 4, 5), CAN_L_AX100U (bidir, see 5), CAN_L_MAIN (bidir, see 4, 5)

### Nets
3V3_COM: C154.2 C155.2 C157.2 C158.2 U18.3(VCC) U19.3(VCC)
GND: C154.1 C155.1 C156.1 C157.1 C158.1 C159.1 R181.2 R187.2 U18.2(GND) U19.2(GND)
CAN_A7_H: R178.1 U18.7(CANH) ; port CAN_H_MAIN
CAN_A7_L: R180.2 U18.6(CANL) ; port CAN_L_MAIN
CAN_AX_H: R184.1 U19.7(CANH) ; port CAN_H_AX100U
CAN_AX_L: R186.2 U19.6(CANL) ; port CAN_L_AX100U
NetC156_2: C156.2 R178.2 R179.1 R180.1
NetC159_2: C159.2 R184.2 R185.1 R186.1
NetR87_2: U18.1(D) ; port CAN1_TX_PD10
NetR89_2: U18.4(R) ; port CAN1_RX_PD11
NetR91_2: U19.1(D) ; port CAN2_TX_PD12
NetR93_2: U19.4(R) ; port CAN2_RX_PD13
NetR179_2: R179.2 U18.5(VREF)
NetR181_1: R181.1 U18.8(RS)
NetR185_2: R185.2 U19.5(VREF)
NetR187_1: R187.1 U19.8(RS)

### Notes on the sheet
- Project:
- BEE-1012
- Sub-system:
- SATELLITE_EXP_CONTROLLER
- Design by:
- SANG HUYNH
- BAO BUI
- Sheet title:
- Sheet
- A3
- of
- Checked by:
- Approved by:
- VU PHAM
- Revision:
- Document No:
- Size:
- Date:

### Library data of the parts
C154-C159 = _CAP_C_2: CAP CHIP
R178-R181 R184-R187 = _RES_B_2: RES
U18 U19 = SN65HVD230DR: 3.3 V CAN Transceiver with Standby Mode; MF: Texas Instruments; SnapEDA_Link: https://www.snapeda.com/parts/SN65HVD230DR/Texas+Instruments/view-part/?ref=snap; Package: SOIC-8 Texas Instruments; Value: *; MP: SN65HVD230DR; Check_prices: https://www.snapeda.com/parts/SN65HVD230DR/Texas+Instruments/view-part/?ref=eda